# EAGLE design SolarPowerBoard (EAGLE 9.2.2)
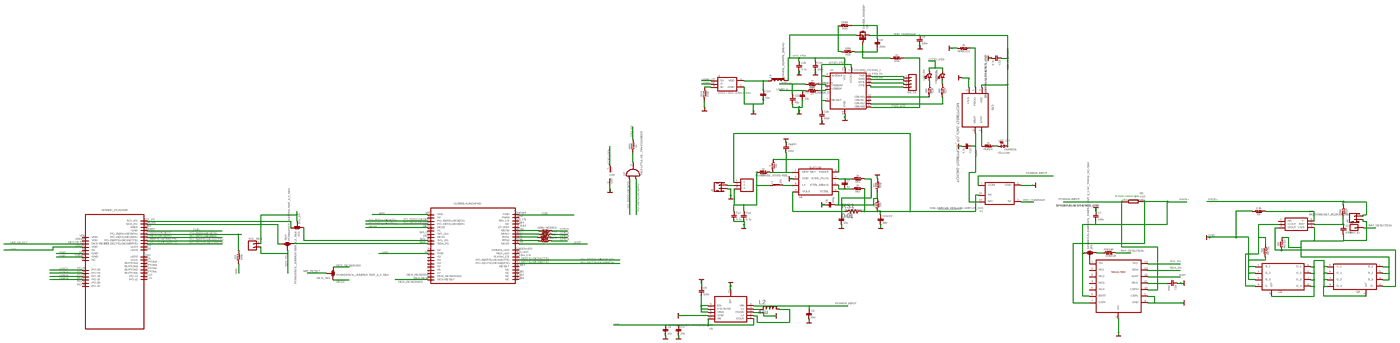
[diagram p0: schematic, sheet 1, overview]
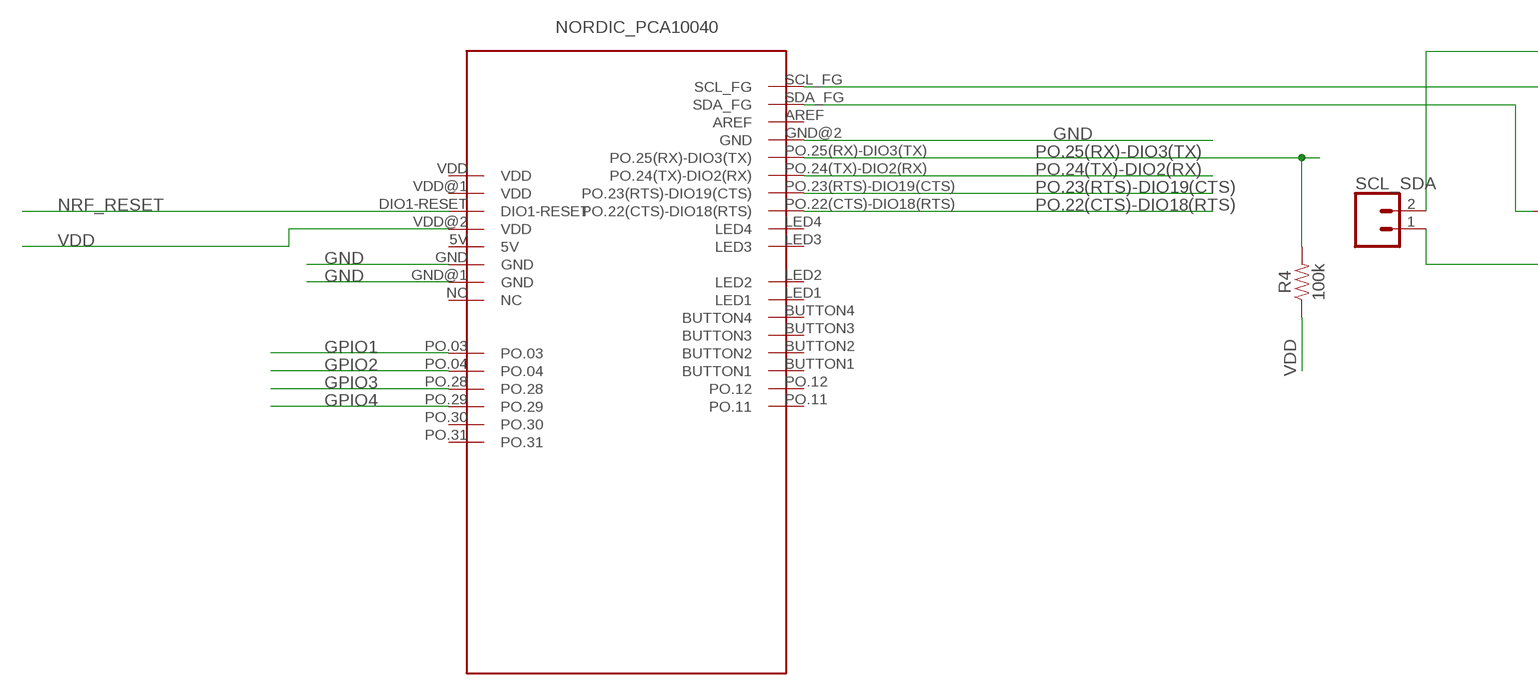
[diagram p1: schematic, sheet 1, part 1 of 4]
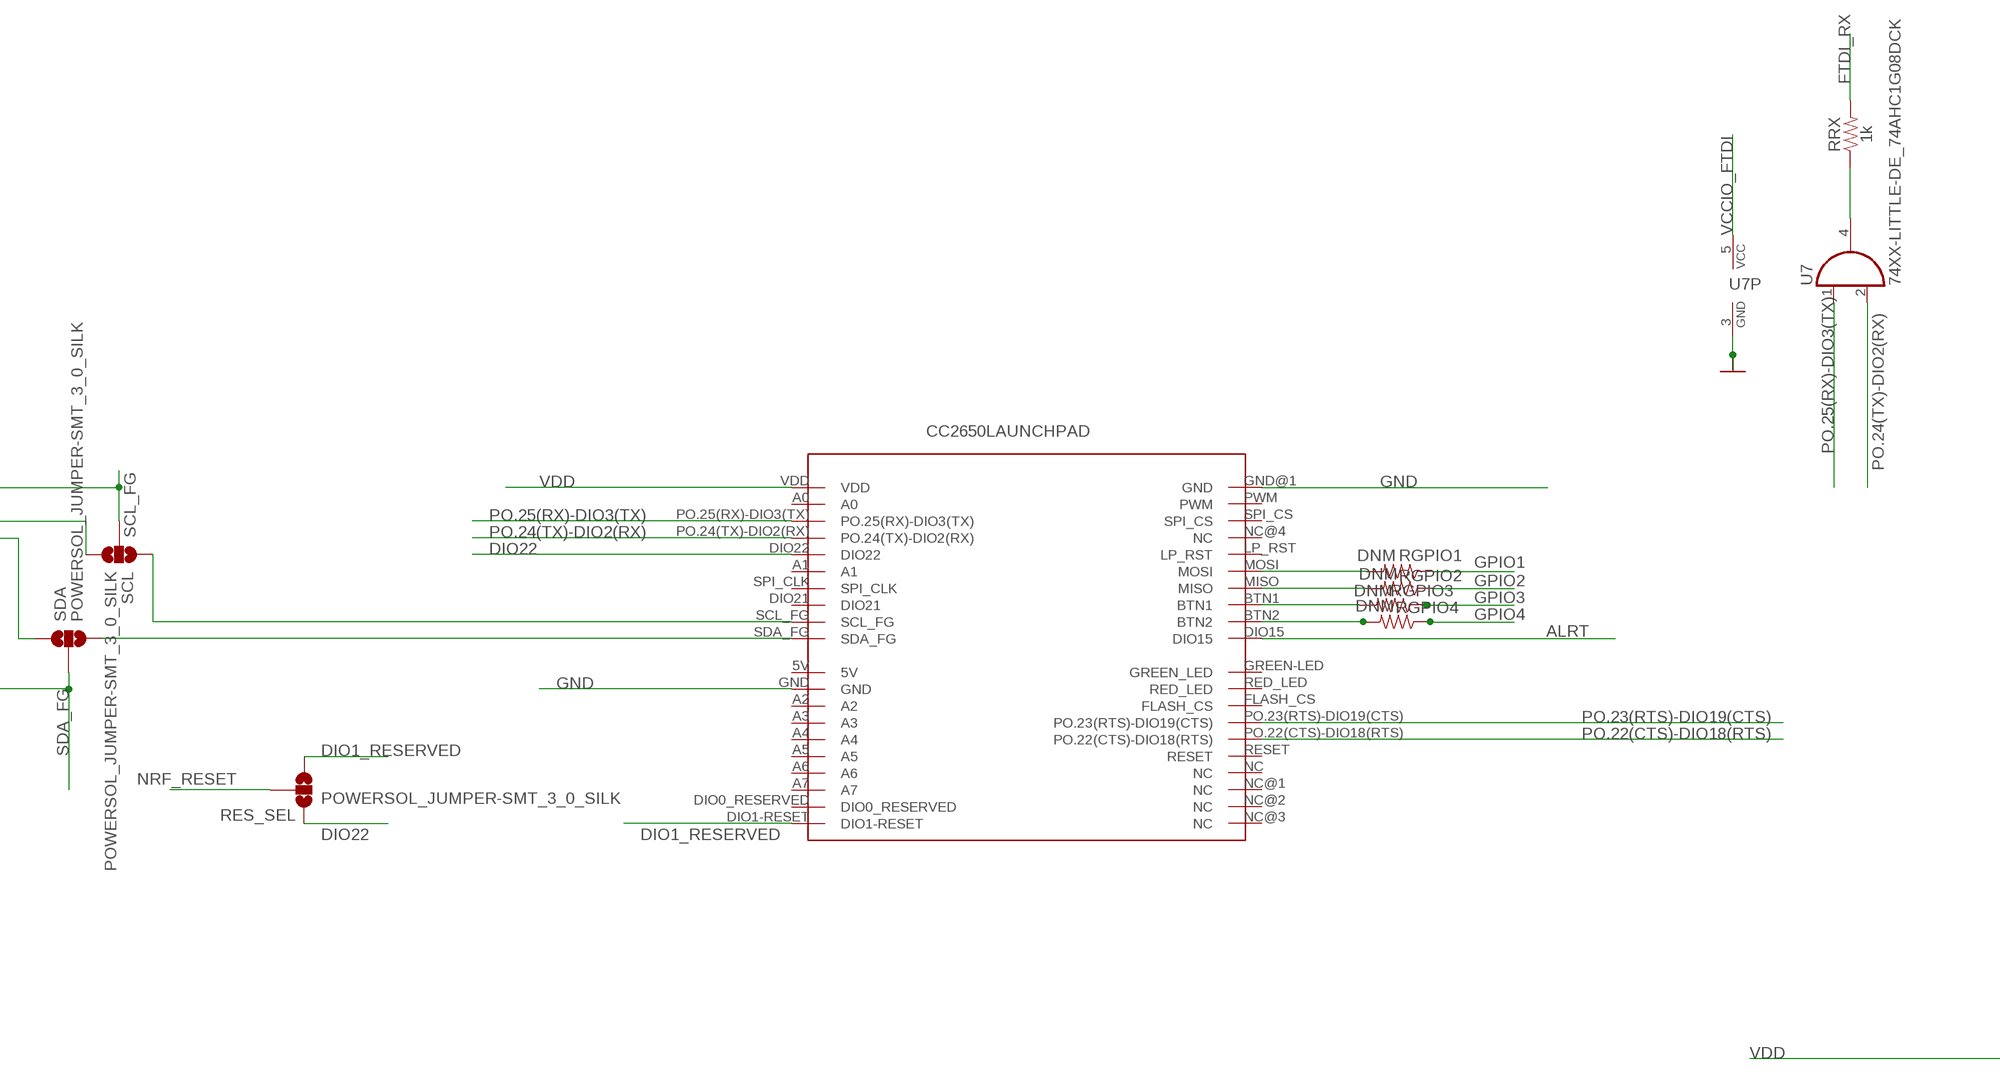
[diagram p2: schematic, sheet 1, part 2 of 4]
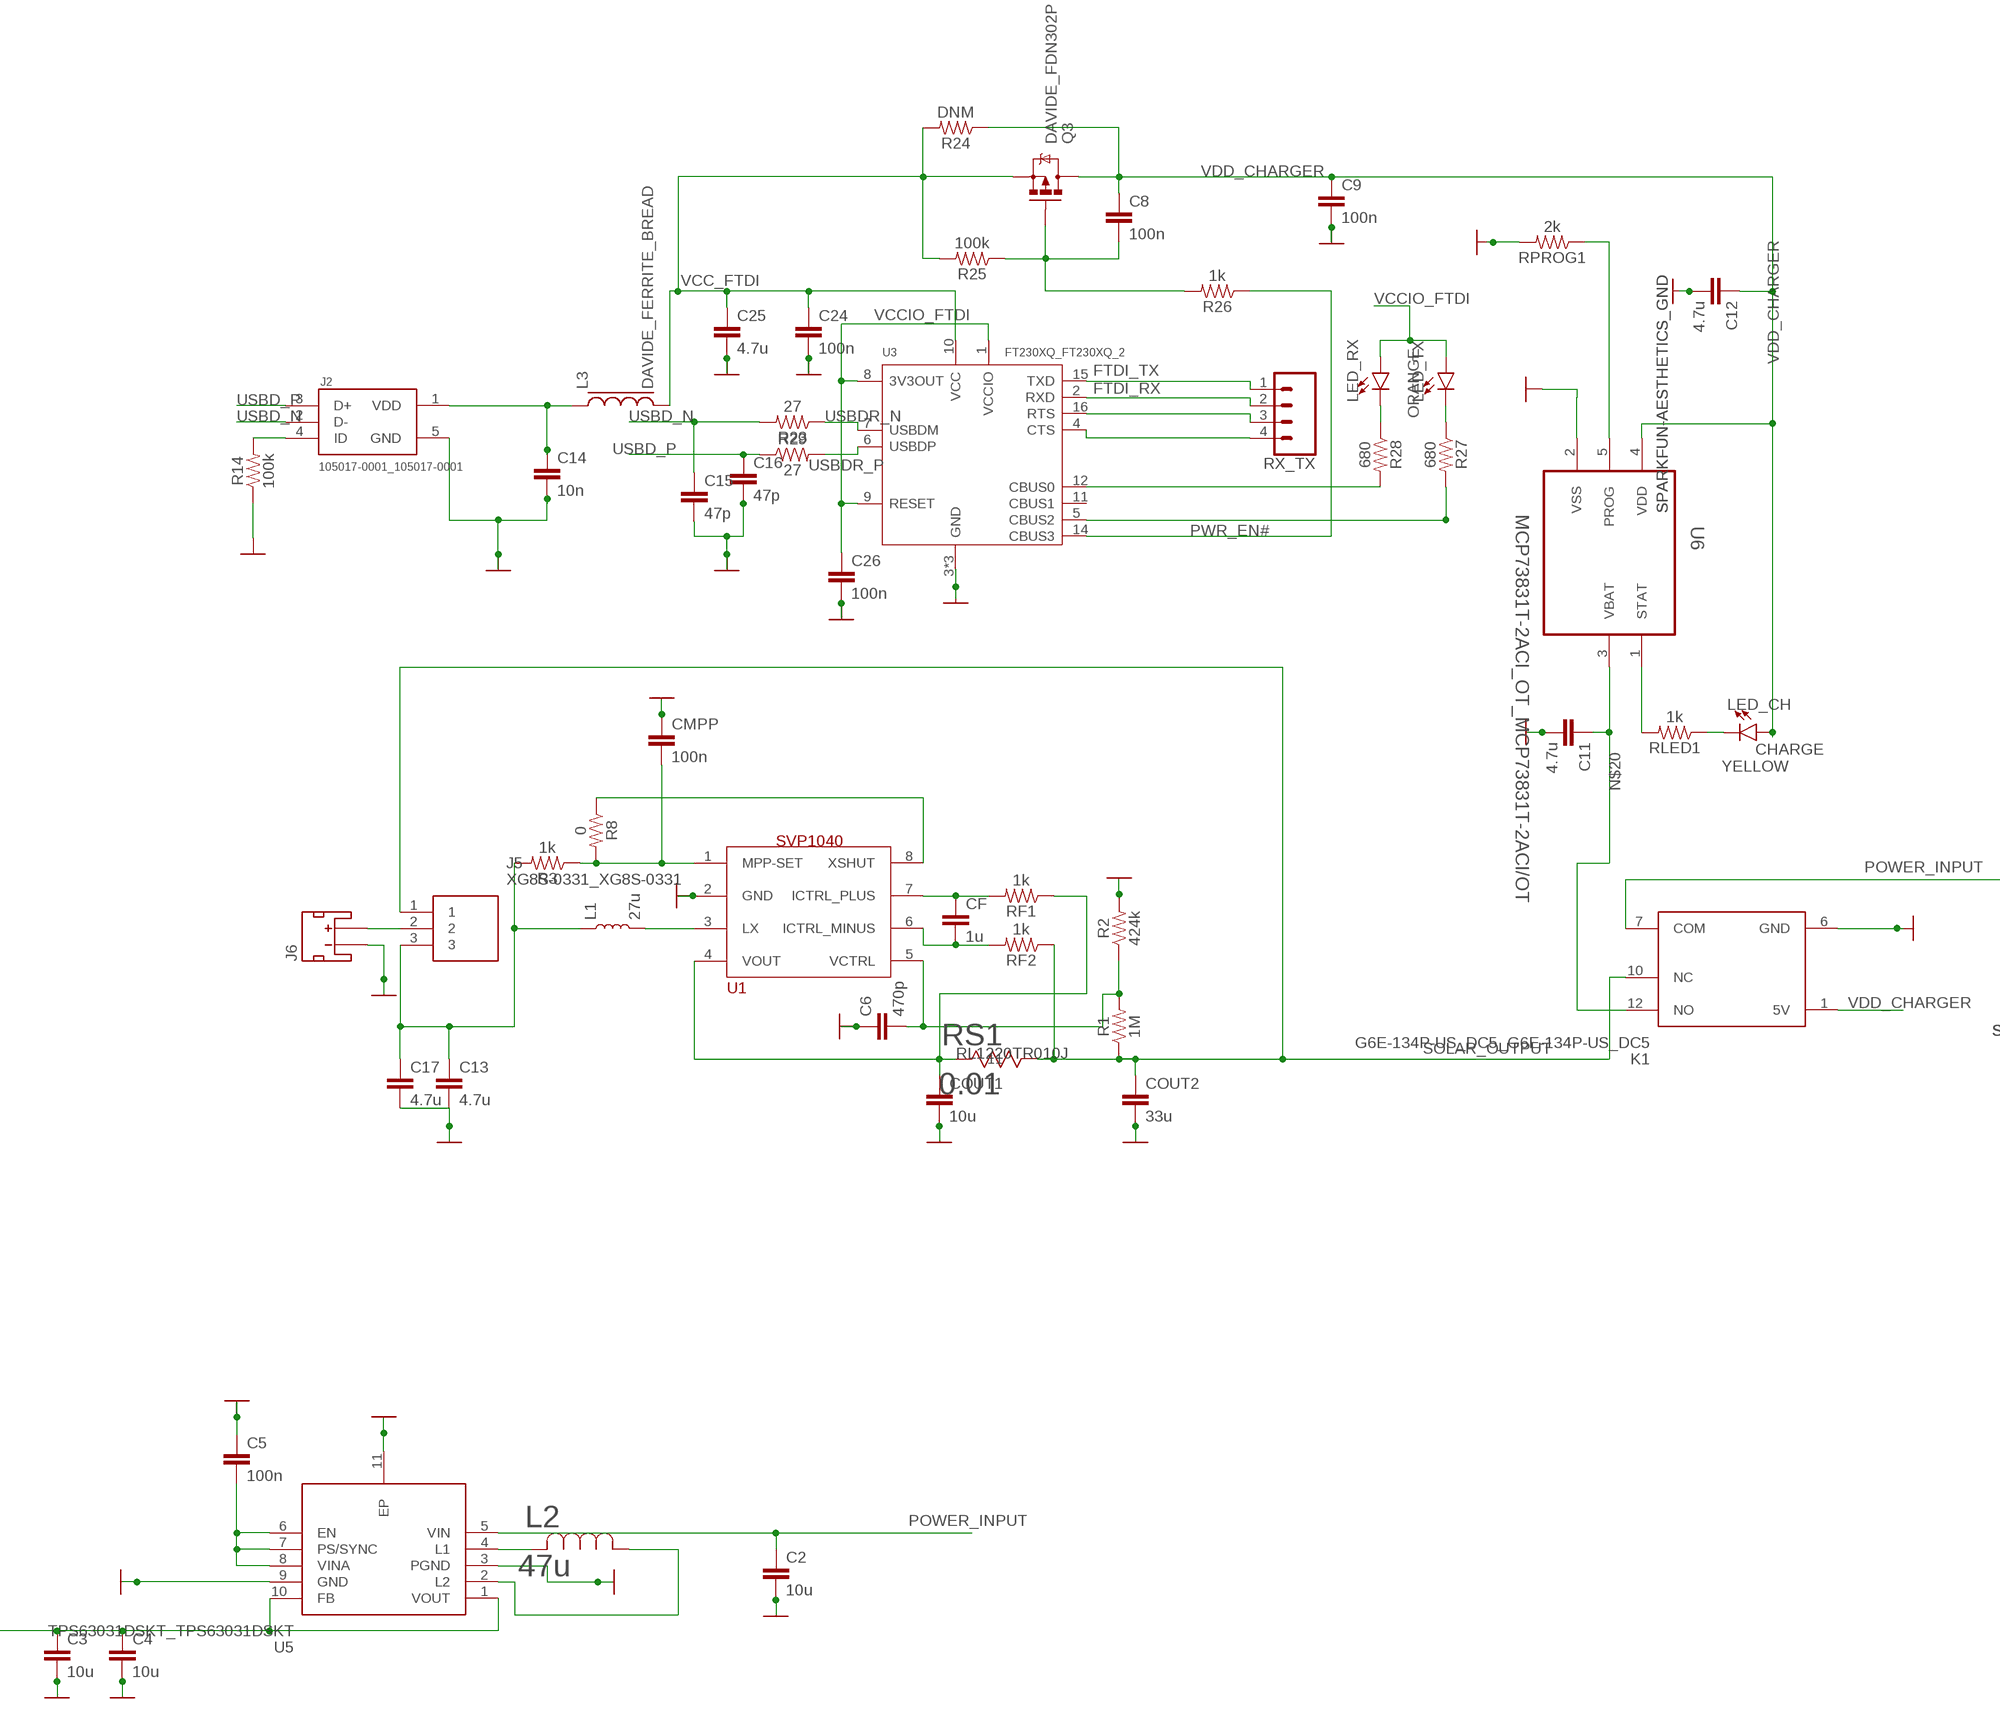
[diagram p3: schematic, sheet 1, part 3 of 4]
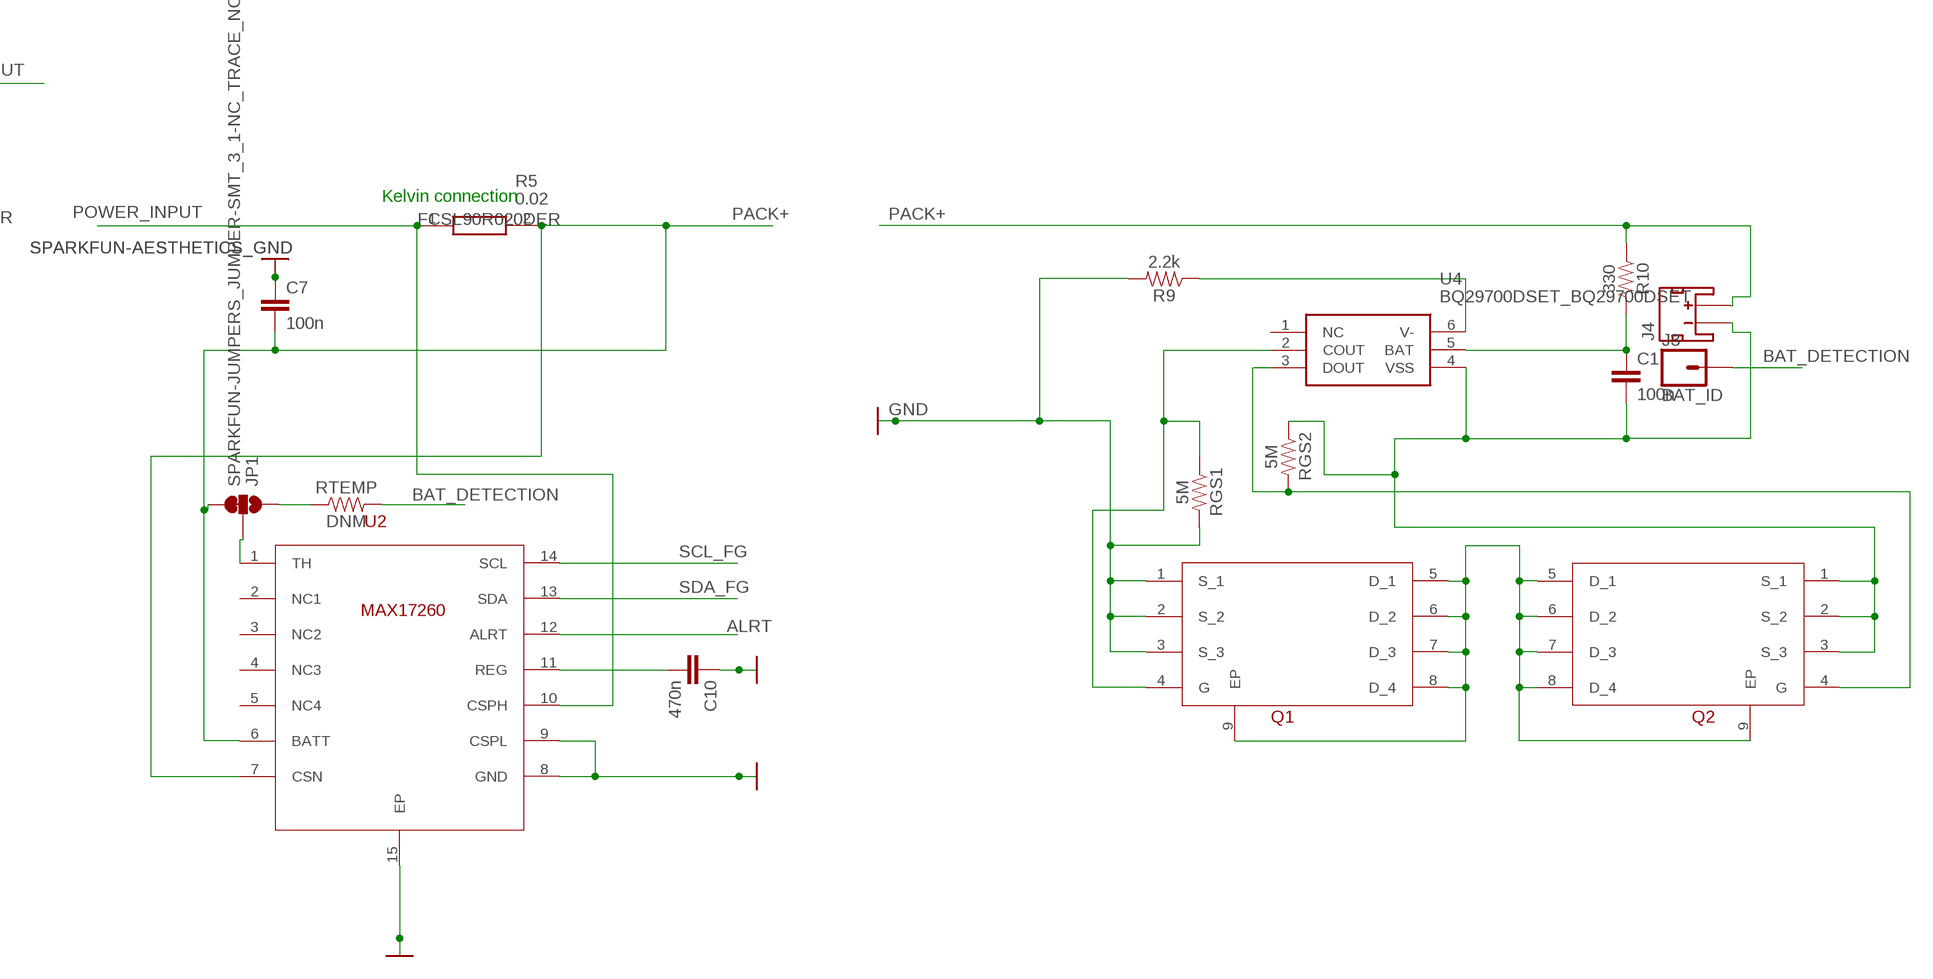
[diagram p4: schematic, sheet 1, part 4 of 4]

## Parts
B1  POWERSOL_CC2650LAUNCHPAD  [POWERSOL_SEPS_RB]
B2  POWERSOL_PCA10040NORDIC  [POWERSOL_SEPS_BB]
C1  100n  SPARKFUN-CAPACITORS_10UF-0805-10V-10%  [SPARKFUN-CAPACITORS_0805]
C2  10u  SPARKFUN-CAPACITORS_10UF-0805-10V-10%  [SPARKFUN-CAPACITORS_0805]
C3  10u  SPARKFUN-CAPACITORS_10UF-0805-10V-10%  [SPARKFUN-CAPACITORS_0805]
C4  10u  SPARKFUN-CAPACITORS_10UF-0805-10V-10%  [SPARKFUN-CAPACITORS_0805]
C5  100n  SPARKFUN-CAPACITORS_10UF-0805-10V-10%  [SPARKFUN-CAPACITORS_0805]
C6  470p  SPARKFUN-CAPACITORS_10UF-0805-10V-10%  [SPARKFUN-CAPACITORS_0805]
C7  100n  SPARKFUN-CAPACITORS_10UF-0805-10V-10%  [SPARKFUN-CAPACITORS_0805]
C8  100n  SPARKFUN-CAPACITORS_10UF-0805-10V-10%  [SPARKFUN-CAPACITORS_0805]
C9  100n  SPARKFUN-CAPACITORS_10UF-0805-10V-10%  [SPARKFUN-CAPACITORS_0805]
C10  470n  SPARKFUN-CAPACITORS_10UF-0805-10V-10%  [SPARKFUN-CAPACITORS_0805]
C11  4.7u  SPARKFUN-CAPACITORS_10UF-0805-10V-10%  [SPARKFUN-CAPACITORS_0805]
C12  4.7u  SPARKFUN-CAPACITORS_10UF-0805-10V-10%  [SPARKFUN-CAPACITORS_0805]
C13  4.7u  SPARKFUN-CAPACITORS_10UF-0805-10V-10%  [SPARKFUN-CAPACITORS_0805]
C14  10n  SPARKFUN-CAPACITORS_10UF-0805-10V-10%  [SPARKFUN-CAPACITORS_0805]
C15  47p  SPARKFUN-CAPACITORS_10UF-0805-10V-10%  [SPARKFUN-CAPACITORS_0805]
C16  47p  SPARKFUN-CAPACITORS_10UF-0805-10V-10%  [SPARKFUN-CAPACITORS_0805]
C17  4.7u  SPARKFUN-CAPACITORS_10UF-0805-10V-10%  [SPARKFUN-CAPACITORS_0805]
C24  100n  SPARKFUN-CAPACITORS_10UF-0805-10V-10%  [SPARKFUN-CAPACITORS_0805]
C25  4.7u  SPARKFUN-CAPACITORS_10UF-0805-10V-10%  [SPARKFUN-CAPACITORS_0805]
C26  100n  SPARKFUN-CAPACITORS_10UF-0805-10V-10%  [SPARKFUN-CAPACITORS_0805]
CF  1u  SPARKFUN-CAPACITORS_10UF-0805-10V-10%  [SPARKFUN-CAPACITORS_0805]
CMPP  100n  SPARKFUN-CAPACITORS_10UF-0805-10V-10%  [SPARKFUN-CAPACITORS_0805]
COUT1  10u  SPARKFUN-CAPACITORS_10UF-0805-10V-10%  [SPARKFUN-CAPACITORS_0805]
COUT2  33u  SPARKFUN-CAPACITORS_10UF-0805-10V-10%  [SPARKFUN-CAPACITORS_0805]
J2  105017-0001_105017-0001  [105017-0001_MOLEX_105017-0001]
J3  BAT_ID  SPARKFUN-CONNECTORS_CONN_01  [SPARKFUN-CONNECTORS_1X01]
J4  SOLARCOMPONENTS_JST_2MM_MALE  [SOLARCOMPONENTS_JST-2-SMD]
J5  XG8S-0331_XG8S-0331  [XG8S-0331_HDRV3W70P0X254_1X3_760X280X680]
J6  SOLARCOMPONENTS_JST_2MM_MALE  [SOLARCOMPONENTS_JST-2-SMD]
JP1  SPARKFUN-JUMPERS_JUMPER-SMT_3_1-NC_TRACE_NO-SILK  [SPARKFUN-JUMPERS_SMT-JUMPER_3_1-NC_TRACE_NO-SILK]
K1  G6E-134P-US_DC5_G6E-134P-US_DC5  [G6E-134P-US_DC5_DIP762W60P254L1595H800Q12N]
L1  27u  INDUCTOR_TH  [AXIAL-14MM]
L2  47u  SRN3010-470M_SRN3010-470M  [SRN3010-470M_IND_BOURNS_SRN3010]
L3  DAVIDE_FERRITE_BREAD  [DAVIDE_0805:1]
LED_CH  LED0603  [LED-0603]
LED_RX  LED0603  [LED-0603]
LED_TX  LED0603  [LED-0603]
Q1  SOLARCOMPONENTS_CSD16406Q3  [SOLARCOMPONENTS_CSD16327]
Q2  SOLARCOMPONENTS_CSD16406Q3  [SOLARCOMPONENTS_CSD16327]
Q3  DAVIDE_FDN302P  [DAVIDE_SOT23-3]
R1  1M  SPARKFUN-RESISTORS_0.3OHM  [SPARKFUN-RESISTORS_0805]
R2  424k  SPARKFUN-RESISTORS_0.3OHM  [SPARKFUN-RESISTORS_0805]
R3  1k  SPARKFUN-RESISTORS_0.3OHM  [SPARKFUN-RESISTORS_0805]
R4  100k  SPARKFUN-RESISTORS_0.3OHM  [SPARKFUN-RESISTORS_0805]
R5  0.02  FCSL90R020DER  [FCSL90R020DER_FOOTPRINT]
R8  0  SPARKFUN-RESISTORS_0.3OHM  [SPARKFUN-RESISTORS_0805]
R9  2.2k  SPARKFUN-RESISTORS_0.3OHM  [SPARKFUN-RESISTORS_0805]
R10  330  SPARKFUN-RESISTORS_0.3OHM  [SPARKFUN-RESISTORS_0805]
R14  100k  SPARKFUN-RESISTORS_0.3OHM  [SPARKFUN-RESISTORS_0805]
R23  27  SPARKFUN-RESISTORS_0.3OHM  [SPARKFUN-RESISTORS_0805]
R24  DNM  SPARKFUN-RESISTORS_0.3OHM  [SPARKFUN-RESISTORS_0805]
R25  100k  SPARKFUN-RESISTORS_0.3OHM  [SPARKFUN-RESISTORS_0805]
R26  1k  SPARKFUN-RESISTORS_0.3OHM  [SPARKFUN-RESISTORS_0805]
R27  680  SPARKFUN-RESISTORS_0.3OHM  [SPARKFUN-RESISTORS_0805]
R28  680  SPARKFUN-RESISTORS_0.3OHM  [SPARKFUN-RESISTORS_0805]
R29  27  SPARKFUN-RESISTORS_0.3OHM  [SPARKFUN-RESISTORS_0805]
RES_SEL  POWERSOL_JUMPER-SMT_3_0_SILK  [POWERSOL_SMT-JUMPER_3_0_NC_TRACE_SILK]
RF1  1k  SPARKFUN-RESISTORS_0.3OHM  [SPARKFUN-RESISTORS_0805]
RF2  1k  SPARKFUN-RESISTORS_0.3OHM  [SPARKFUN-RESISTORS_0805]
RGPIO1  DNM  SPARKFUN-RESISTORS_0.3OHM  [SPARKFUN-RESISTORS_0805]
RGPIO2  DNM  SPARKFUN-RESISTORS_0.3OHM  [SPARKFUN-RESISTORS_0805]
RGPIO3  DNM  SPARKFUN-RESISTORS_0.3OHM  [SPARKFUN-RESISTORS_0805]
RGPIO4  DNM  SPARKFUN-RESISTORS_0.3OHM  [SPARKFUN-RESISTORS_0805]
RGS1  5M  SPARKFUN-RESISTORS_0.3OHM  [SPARKFUN-RESISTORS_0805]
RGS2  5M  SPARKFUN-RESISTORS_0.3OHM  [SPARKFUN-RESISTORS_0805]
RLED1  1k  SPARKFUN-RESISTORS_0.3OHM  [SPARKFUN-RESISTORS_0805]
RPROG1  2k  SPARKFUN-RESISTORS_0.3OHM  [SPARKFUN-RESISTORS_0805]
RRX  1k  SPARKFUN-RESISTORS_0.3OHM  [SPARKFUN-RESISTORS_0805]
RS1  0.01  RL1220T-R010-J_RL1220T-R010-J  [RL1220T-R010-J_RES_1220]
RTEMP  DNM  SPARKFUN-RESISTORS_0.3OHM  [SPARKFUN-RESISTORS_0805]
RX_TX  SPARKFUN-CONNECTORS_CONN_04  [SPARKFUN-CONNECTORS_1X04]
SCL  POWERSOL_JUMPER-SMT_3_0_SILK  [POWERSOL_SMT-JUMPER_3_0_NC_TRACE_SILK]
SCL_SDA  SPARKFUN-CONNECTORS_CONN_02  [SPARKFUN-CONNECTORS_1X02]
SDA  POWERSOL_JUMPER-SMT_3_0_SILK  [POWERSOL_SMT-JUMPER_3_0_NC_TRACE_SILK]
U1  SOLARCOMPONENTS_SVP1040  [SOLARCOMPONENTS_TSSOP-8]
U2  SOLARCOMPONENTS_MAX17260  [SOLARCOMPONENTS_SON40P300X300X80-15N]
U3  FT230XQ_FT230XQ_2  [FT230XQ_QFN16]
U4  BQ29700DSET_BQ29700DSET  [BQ29700DSET_SON50P150X150X80-6N]
U5  TPS63031DSKT_TPS63031DSKT  [TPS63031DSKT_SON50P250X250X80-11N]
U6  MCP73831T-2ACI_OT_MCP73831T-2ACI/OT  [MCP73831T-2ACI_OT_SOT95P280X145-5N]
U7  74XX-LITTLE-DE_74AHC1G08DCK  [74XX-LITTLE-DE_SC70-5]

## Nets
ALRT: B1.DIO15 U2.12(ALRT)
BAT_DETECTION: J3.1 RTEMP.2
DIO1_RESERVED: B1.DIO1-RESET RES_SEL.3
DIO22: B1.DIO22 RES_SEL.1
DP5_UART_FTDI_RX: RRX.1 U7.4(O)
FTDI_RX: RRX.2 RX_TX.2 U3.2(RXD)
FTDI_TX: RX_TX.1 U3.15(TXD)
GND: B1.GND B1.GND@1(GND) B2.GND B2.GND@1(GND) B2.GND@2(GND) C2.2 C3.2 C4.2 C5.1 C6.1 C7.1 C9.2 C10.1 C11.2 C12.2 C13.2 C14.2 C15.2 C16.2 C17.2 C24.2 C25.2 C26.2 CMPP.1 COUT1.2 COUT2.2 J2.5(GND) J6.1(-) J6.P$1(-) K1.6(GND) Q1.1(S_1) Q1.2(S_2) Q1.3(S_3) R2.2 R9.2 R14.1 RGS1.2 RPROG1.2 U1.2(GND) U2.8(GND) U2.9(CSPL) U2.15(EP) U3.3(GND) U3.13(GND) U3.17(GND) U5.3(PGND) U5.9(GND) U5.11(EP) U6.2(VSS) U7.3(GND) ; supply symbol labelled SPARKFUN-AESTHETICS_GND
GPIO1: B2.PO.03 RGPIO1.1
GPIO2: B2.PO.04 RGPIO2.1
GPIO3: B2.PO.28 RGPIO3.1
GPIO4: B2.PO.29 RGPIO4.1
N$1: C13.1 C17.1 J5.3 L1.P$1 R3.2
N$2: RPROG1.1 U6.5(PROG)
N$3: CMPP.2 R3.1 R8.2 U1.1(MPP-SET)
N$4: R8.1 U1.8(XSHUT)
N$5: COUT1.1 RF1.1 RS1.1 U1.4(VOUT)
N$6: CF.1 RF1.2 U1.7(ICTRL_PLUS)
N$7: CF.2 RF2.2 U1.6(ICTRL_MINUS)
N$8: L2.2 U5.4(L1)
N$9: LED_CH.C RLED1.1
N$10: C6.2 R1.2 R2.1 U1.5(VCTRL)
N$11: C5.2 U5.6(EN) U5.7(PS/SYNC) U5.8(VINA)
N$12: L2.1 U5.2(L2)
N$13: RLED1.2 U6.1(STAT)
N$14: Q1.5(D_1) Q1.6(D_2) Q1.7(D_3) Q1.8(D_4) Q1.9(EP) Q2.5(D_1) Q2.6(D_2) Q2.7(D_3) Q2.8(D_4) Q2.9(EP)
N$15: Q1.4(G) RGS1.1 U4.2(COUT)
N$16: J5.2 J6.2(+) J6.P$2(+)
N$17: JP1.2 U2.1(TH)
N$18: L1.P$2 U1.3(LX)
N$19: C1.2 J4.1(-) J4.P$1(-) Q2.1(S_1) Q2.2(S_2) Q2.3(S_3) RGS2.1 U4.4(VSS)
N$20: C11.1 K1.12(NO) U6.3(VBAT)
N$21: JP1.1 RTEMP.1
N$22: Q2.4(G) RGS2.2 U4.3(DOUT)
N$24: C1.1 R10.2 U4.5(BAT)
N$25: C14.1 J2.1(VDD) L3.1
N$26: C8.2 Q3.1(G) R25.1 R26.2
N$27: J2.4(ID) R14.2
N$28: B1.MOSI RGPIO1.2
N$29: R9.1 U4.6(V-)
N$30: B1.MISO RGPIO2.2
N$31: R28.2 U3.12(CBUS0)
N$32: LED_RX.C R28.1
N$33: B1.BTN1 RGPIO3.2
N$34: RX_TX.3 U3.16(RTS)
N$35: RX_TX.4 U3.4(CTS)
N$36: B1.SDA_FG SDA.3
N$37: B1.SCL_FG SCL.1
N$38: B2.SDA_FG SDA.1
N$39: B2.SCL_FG SCL.3
N$41: B1.BTN2 RGPIO4.2
N$42: LED_TX.C R27.1
N$43: R27.2 U3.5(CBUS2)
N$45: C10.2 U2.11(REG)
NRF_RESET: B2.DIO1-RESET RES_SEL.2
PACK+: C7.2 J4.2(+) J4.P$2(+) JP1.3 R5.2 R10.1 U2.6(BATT) U2.7(CSN)
PO.22(CTS)-DIO18(RTS): B1.PO.22(CTS)-DIO18(RTS) B2.PO.22(CTS)-DIO18(RTS)
PO.23(RTS)-DIO19(CTS): B1.PO.23(RTS)-DIO19(CTS) B2.PO.23(RTS)-DIO19(CTS)
PO.24(TX)-DIO2(RX): B1.PO.24(TX)-DIO2(RX) B2.PO.24(TX)-DIO2(RX) U7.2(I1)
PO.25(RX)-DIO3(TX): B1.PO.25(RX)-DIO3(TX) B2.PO.25(RX)-DIO3(TX) R4.2 U7.1(I0)
POWER_INPUT: C2.1 K1.7(COM) R5.1 U2.10(CSPH) U5.5(VIN)
PWR_EN#: R26.1 U3.14(CBUS3)
SCL_FG: SCL.2 SCL_SDA.2 U2.14(SCL)
SDA_FG: SCL_SDA.1 SDA.2 U2.13(SDA)
SOLAR_OUTPUT: COUT2.1 J5.1 K1.10(NC) R1.1 RF2.1 RS1.2
USBD_N: C15.1 J2.2(D-) R23.2
USBD_P: C16.1 J2.3(D+) R29.1
USBDR_N: R23.1 U3.7(USBDM)
USBDR_P: R29.2 U3.6(USBDP)
VCC_FTDI: C24.1 C25.1 L3.2 Q3.2(S) R24.2 R25.2 U3.10(VCC)
VCCIO_FTDI: C26.1 LED_RX.A LED_TX.A U3.1(VCCIO) U3.8(3V3OUT) U3.9(RESET) U7.5(VCC)
VDD: B1.VDD B2.VDD@2(VDD) C3.1 C4.1 R4.1 U5.1(VOUT) U5.10(FB)
VDD_CHARGER: C8.1 C9.1 C12.1 K1.1(5V) LED_CH.A Q3.3(D) R24.1 U6.4(VDD)
Unconnected: B1.5V B1.A0 B1.A1 B1.A2 B1.A3 B1.A4 B1.A5 B1.A6 B1.A7 B1.DIO0_RESERVED B1.DIO21 B1.FLASH_CS B1.GREEN-LED(GREEN_LED) B1.LP_RST B1.NC B1.NC@1(NC) B1.NC@2(NC) B1.NC@3(NC) B1.NC@4(NC) B1.PWM B1.RED_LED B1.RESET B1.SPI_CLK B1.SPI_CS B2.5V B2.AREF B2.BUTTON1 B2.BUTTON2 B2.BUTTON3 B2.BUTTON4 B2.LED1 B2.LED2 B2.LED3 B2.LED4 B2.NC B2.PO.11 B2.PO.12 B2.PO.30 B2.PO.31 B2.VDD B2.VDD@1(VDD) J4.NC1(PAD1) J4.NC2(PAD2) J6.NC1(PAD1) J6.NC2(PAD2) U2.2(NC1) U2.3(NC2) U2.4(NC3) U2.5(NC4) U3.11(CBUS1) U4.1(NC)

## Notes on the sheet
- Kelvin connection

## Library data of the parts
B1 = SolarPowerBoard:POWERSOL_CC2650LAUNCHPAD: CC2650 LaunchPad; MPN: LAUNCHXL-CC2650; OC_NEWARK: 82Y0957
B2 = SolarPowerBoard:POWERSOL_PCA10040NORDIC: Blue Board; OC_NEWARK: unknown
C1-C17 C24-C26 CF CMPP COUT1 COUT2 = SolarPowerBoard:SPARKFUN-CAPACITORS_10UF: 10.0µF ceramic capacitors A capacitor is a passive two-terminal electrical component used to store electrical energy temporarily in an electric field.; MF: AVX CORPORATION; MPN: TPSP106M010R2000; OC_NEWARK: 22K2788; PROD_ID: CAP-11330
J2 = SolarPowerBoard:105017-0001_105017-0001; AVAILABILITY: Good; DESCRIPTION: Conn USB Type B M 5 POS 0.65mm Solder RA Thru-Hole 5 Terminal 1 Port Embossed T/R; MP: 105017-0001; MPN: 105017-0001; OC_NEWARK: 28X2628; PACKAGE: None; PRICE: 0.49 USD
J3 = SolarPowerBoard:SPARKFUN-CONNECTORS_CONN_01: Single connection point. Often used as Generic Header-pin footprint for 0.1 inch spaced/style header connections On any of the 0.1 inch spaced packages, you can populate with these: Break Away Headers - Straight <https://www.sparkfun.com/products/116> (PRT-00116) Break Away Male Headers - Right Angle <https://www.sparkfun.com/products/553> (PRT-00553) Female Headers <https://www.sparkfun.com/products/115> (PRT-00115) Break Away Headers - Machine Pin <https://www.sparkfun.com/products/117> (PRT-00117) Break Away Female Headers - Swiss Machine Pin <https://www.sparkfun.com/products/743> (PRT-00743) This device is also useful as a general connection point to wire up your design to another part of your project. Our various solder wires solder well into these plated through hole pads. Hook-Up Wire - Assortment (Stranded, 22 AWG) <https://www.sparkfun.com/products/11375> (PRT-11375) Hook-Up Wire - Assortment (Solid Core, 22 AWG) <https://www.sparkfun.com/products/11367> (PRT-11367) View the entire wire category on our website here <https://www.sparkfun.com/categories/141> Special notes: SMTSO-256-ET is a "flush mount" nut for a 4-40 screw. We mostly use this on specialty testbeds; it is a nice way to connect hardware to your PCB at an adjustable hieght. Also note, the SNAP packages are for using a snappable style connector. We sell a baggie of snaps and they are also used on two LilyPad designs: Snap Assortment - 30 pack (male and female) <https://www.sparkfun.com/products/11347> (DEV-11347) LilyPad Arduino SimpleSnap <https://www.sparkfun.com/products/10941> (DEV-10941) LilyPad SimpleSnap Protoboard <https://www.sparkfun.com/products/10940> (DEV-10940)
J4 J6 = SolarPowerBoard:SOLARCOMPONENTS_JST_2MM_MALE: JST 2MM MALE RA CONNECTOR Two pin, compact surface mount connector. Commonly used as a battery input connection point. We really like the solid locking feeling and high current rating on these small connectors. We use these all the time as battery connectors. Mates to single-cell LiPo batteries. Here is the connector we sell at SparkFun: JST Right Angle Connector - White <https://www.sparkfun.com/products/8612> (PRT-08612) Datasheet <http://www.sparkfun.com/datasheets/Prototyping/Connectors/JST-Horizontal.pdf> It was used on these SparkFun products: SparkFun MOSFET Power Controller <https://www.sparkfun.com/products/11214> (PRT-11214) SparkFun Battery Babysitter - LiPo Battery Manager <https://www.sparkfun.com/products/13777> (PRT-13777) And many, many others that required a lipo battery connection.; PROD_ID: CONN-11443; SF_ID: PRT-08612
J5 = SolarPowerBoard:XG8S-0331_XG8S-0331: Headers & Wire Housings Header Plug Au Plate Single Row 3 Pin Source: Datasheet <https://www.arrow.com/en/products/xg8s-0331/omron>; ARROW_PART_NUMBER: XG8S-0331; DESCRIPTION: Headers & Wire Housings Header Plug Au Plate Single Row 3 Pin; HEIGHT: 6.8mm; MANUFACTURER_NAME: Omron Electronics; MANUFACTURER_PART_NUMBER: XG8S-0331
JP1 = SolarPowerBoard:SPARKFUN-JUMPERS_JUMPER-SMT_3_1-NC_TRACE: Normally closed trace jumper (1 of 2 connections) This jumper has a trace between two pads so it's normally closed (NC). The other connection is normally open (NO). Use a razor knife to open the connection. For best results follow the IPC guidelines for cutting traces: Cutout at least 0.063 mm (0.005 in). Remove all loose material to clean up the cut area. Seal the cut with an approved epoxy. Reapply solder to reclose the connection, or to close the NO connection.; OC_NEWARK: unknown
K1 = SolarPowerBoard:G6E-134P-US_DC5_G6E-134P-US_DC5: Low Signal Relays - PCB Relay Source: Datasheet <https://componentsearchengine.com/Datasheets/1/G6E-134P-US DC5.pdf>; ARROW_PART_NUMBER: G6E-134P-US DC5; DESCRIPTION: Low Signal Relays - PCB Relay; HEIGHT: 8mm; MANUFACTURER_NAME: Omron Electronics; MANUFACTURER_PART_NUMBER: G6E-134P-US DC5
L1 = SolarPowerBoard:INDUCTOR_TH; MPN: B82144F2273K000
L2 = SolarPowerBoard:SRN3010-470M_SRN3010-470M; MANUFACTURER_PART_NUMBER: SRN3010470M; MPN: SRN3010-470M; OC_NEWARK: 54W0048; VENDOR: Bourns Electronics
L3 = SolarPowerBoard:DAVIDE_FERRITE_BREAD; MPN: MI0805K601R-10; OC_NEWARK: unknown
LED_CH = SolarPowerBoard:LED: LED (Generic) Standard schematic elements and footprints for 5mm, 3mm, 1206, and 0603 sized LEDs. Generic LEDs with no color specified.; COLOR: YELLOW; FUNCTION: CHARGE
LED_RX = SolarPowerBoard:LED: LED (Generic) Standard schematic elements and footprints for 5mm, 3mm, 1206, and 0603 sized LEDs. Generic LEDs with no color specified.; COLOR: ORANGE; FUNCTION: RX
LED_TX = SolarPowerBoard:LED: LED (Generic) Standard schematic elements and footprints for 5mm, 3mm, 1206, and 0603 sized LEDs. Generic LEDs with no color specified.; COLOR: YELLOW; FUNCTION: TX
Q1 Q2 = SolarPowerBoard:SOLARCOMPONENTS_CSD16406Q3; MPN: CSD16406Q3; OC_NEWARK: 06R3511
Q3 = SolarPowerBoard:DAVIDE_FDN302P; OC_NEWARK: unknown
R1-R4 R8-R10 R14 R23-R29 RF1 RF2 RGPIO1-RGPIO4 RGS1 RGS2 RLED1 RPROG1 RRX RTEMP = SolarPowerBoard:SPARKFUN-RESISTORS_0.3OHM: Generic Resistor Package; MPN: RLP73N2AR30JTD; OC_NEWARK: 43AC3996
R5 = SolarPowerBoard:FCSL90R020DER: Susumu Co KRL Series Metal Foil Surface Mount Fixed Resistor 2012 Case 20m 1% 1W 50ppm/C Source: Datasheet <https://www.susumu.co.jp/common/pdf/n_catalog_partition19_en.pdf>; MANUFACTURER_CODE: FCSL90R020DER
RES_SEL SCL SDA = SolarPowerBoard:POWERSOL_JUMPER-SMT_3_0_SILK; OC_NEWARK: unknown
RS1 = SolarPowerBoard:RL1220T-R010-J_RL1220T-R010-J; MANUFACTURER_PART_NUMBER: RL1220TR010J; VENDOR: Susumu
RX_TX = SolarPowerBoard:SPARKFUN-CONNECTORS_CONN_04: Multi connection point. Often used as Generic Header-pin footprint for 0.1 inch spaced/style header connections On any of the 0.1 inch spaced packages, you can populate with these: Break Away Headers - Straight <https://www.sparkfun.com/products/116> (PRT-00116) Break Away Male Headers - Right Angle <https://www.sparkfun.com/products/553> (PRT-00553) Female Headers <https://www.sparkfun.com/products/115> (PRT-00115) Break Away Headers - Machine Pin <https://www.sparkfun.com/products/117> (PRT-00117) Break Away Female Headers - Swiss Machine Pin <https://www.sparkfun.com/products/743> (PRT-00743) For SCREWTERMINALS and SPRING TERMINALS visit here: Screw Terimnals on SparkFun.com <https://www.sparkfun.com/search/results?term=Screw+Terminals> (5mm/3.5mm/2.54mm spacing) This device is also useful as a general connection point to wire up your design to another part of your project. Our various solder wires solder well into these plated through hole pads. Hook-Up Wire - Assortment (Stranded, 22 AWG) <https://www.sparkfun.com/products/11375> (PRT-11375) Hook-Up Wire - Assortment (Solid Core, 22 AWG) <https://www.sparkfun.com/products/11367> (PRT-11367) View the entire wire category on our website here <https://www.sparkfun.com/categories/141> Special notes: Molex polarized connector foot print use with SKU : PRT-08231 with associated crimp pins and housings. 1MM SMD Version SKU: PRT-10208; OC_NEWARK: unknown; PROD_ID: CONN-09696
SCL_SDA = SolarPowerBoard:SPARKFUN-CONNECTORS_CONN_02: Multi connection point. Often used as Generic Header-pin footprint for 0.1 inch spaced/style header connections On any of the 0.1 inch spaced packages, you can populate with these: Break Away Headers - Straight <https://www.sparkfun.com/products/116> (PRT-00116) Break Away Male Headers - Right Angle <https://www.sparkfun.com/products/553> (PRT-00553) Female Headers <https://www.sparkfun.com/products/115> (PRT-00115) Break Away Headers - Machine Pin <https://www.sparkfun.com/products/117> (PRT-00117) Break Away Female Headers - Swiss Machine Pin <https://www.sparkfun.com/products/743> (PRT-00743) For SCREWTERMINALS and SPRING TERMINALS visit here: Screw Terimnals on SparkFun.com <https://www.sparkfun.com/search/results?term=Screw+Terminals> (5mm/3.5mm/2.54mm spacing) This device is also useful as a general connection point to wire up your design to another part of your project. Our various solder wires solder well into these plated through hole pads. Hook-Up Wire - Assortment (Stranded, 22 AWG) <https://www.sparkfun.com/products/11375> (PRT-11375) Hook-Up Wire - Assortment (Solid Core, 22 AWG) <https://www.sparkfun.com/products/11367> (PRT-11367) View the entire wire category on our website here <https://www.sparkfun.com/categories/141> Special notes: Molex polarized connector foot print use with: PRT-08233 with associated crimp pins and housings. 2.54_SCREWTERM for use with PRT-10571. 3.5mm Screw Terminal footprints for PRT-08084 5mm Screw Terminal footprints for use with PRT-08432; OC_NEWARK: unknown
U1 = SolarPowerBoard:SOLARCOMPONENTS_SVP1040; OC_NEWARK: unknown
U2 = SolarPowerBoard:SOLARCOMPONENTS_MAX17260; MPN: MAX17260SEWL+; OC_NEWARK: 62AC7157
U3 = SolarPowerBoard:FT230XQ_FT230XQ_2; MPN: FT230XQ-R; OC_NEWARK: 83T7086
U4 = SolarPowerBoard:BQ29700DSET_BQ29700DSET: Texas Instruments BQ29700DSET, Battery Charger Lithium-Ion, Lithium-Polymer, 6-Pin WSON Source: Datasheet <http://www.ti.com/lit/ds/symlink/bq2970.pdf>; ARROW_PART_NUMBER: BQ29700DSET; ARROW_PRICE-STOCK: https://www.arrow.com/en/products/bq29700dset/texas-instruments; DESCRIPTION: Texas Instruments BQ29700DSET, Battery Charger Lithium-Ion, Lithium-Polymer, 6-Pin WSON; HEIGHT: 0.8mm; MANUFACTURER_NAME: Texas Instruments; MANUFACTURER_PART_NUMBER: BQ29700DSET; MPN: BQ29700DSET; OC_NEWARK: 78X4150; RS_PART_NUMBER: 1456841; RS_PRICE-STOCK: http://uk.rs-online.com/web/p/products/1456841
U5 = SolarPowerBoard:TPS63031DSKT_TPS63031DSKT: High Efficient Single Inductor Buck-Boost Converter with 1-A Switches Source: Datasheet <http://www.ti.com/lit/gpn/tps63031>; ARROW_PART_NUMBER: TPS63031DSKT; ARROW_PRICE-STOCK: https://www.arrow.com/en/products/tps63031dskt/texas-instruments; DESCRIPTION: High Efficient Single Inductor Buck-Boost Converter with 1-A Switches; HEIGHT: 0.8mm; MANUFACTURER_NAME: Texas Instruments; MANUFACTURER_PART_NUMBER: TPS63031DSKT; MPN: TPS63031DSKT; OC_NEWARK: 25P9270; RS_PART_NUMBER: 6989091P; RS_PRICE-STOCK: http://uk.rs-online.com/web/p/products/6989091P
U6 = SolarPowerBoard:MCP73831T-2ACI_OT_MCP73831T-2ACI/OT: Charge Management Controller; AVAILABILITY: Good; DESCRIPTION: MCP73831 Series Single-Cell Li-Ion/Li-Polymer Battery Charge Controller SOT-23-5; MF: Microchip; MP: MCP73831T-2ACI/OT; PACKAGE: SOT-23 Microchip; PRICE: 0.51 USD
U7 = SolarPowerBoard:74XX-LITTLE-DE_74*1G08: 2-input AND gate; MF: TEXAS INSTRUMENTS; MPN: SN74AHC1G08DCKR; OC_NEWARK: 19C1781

## Board
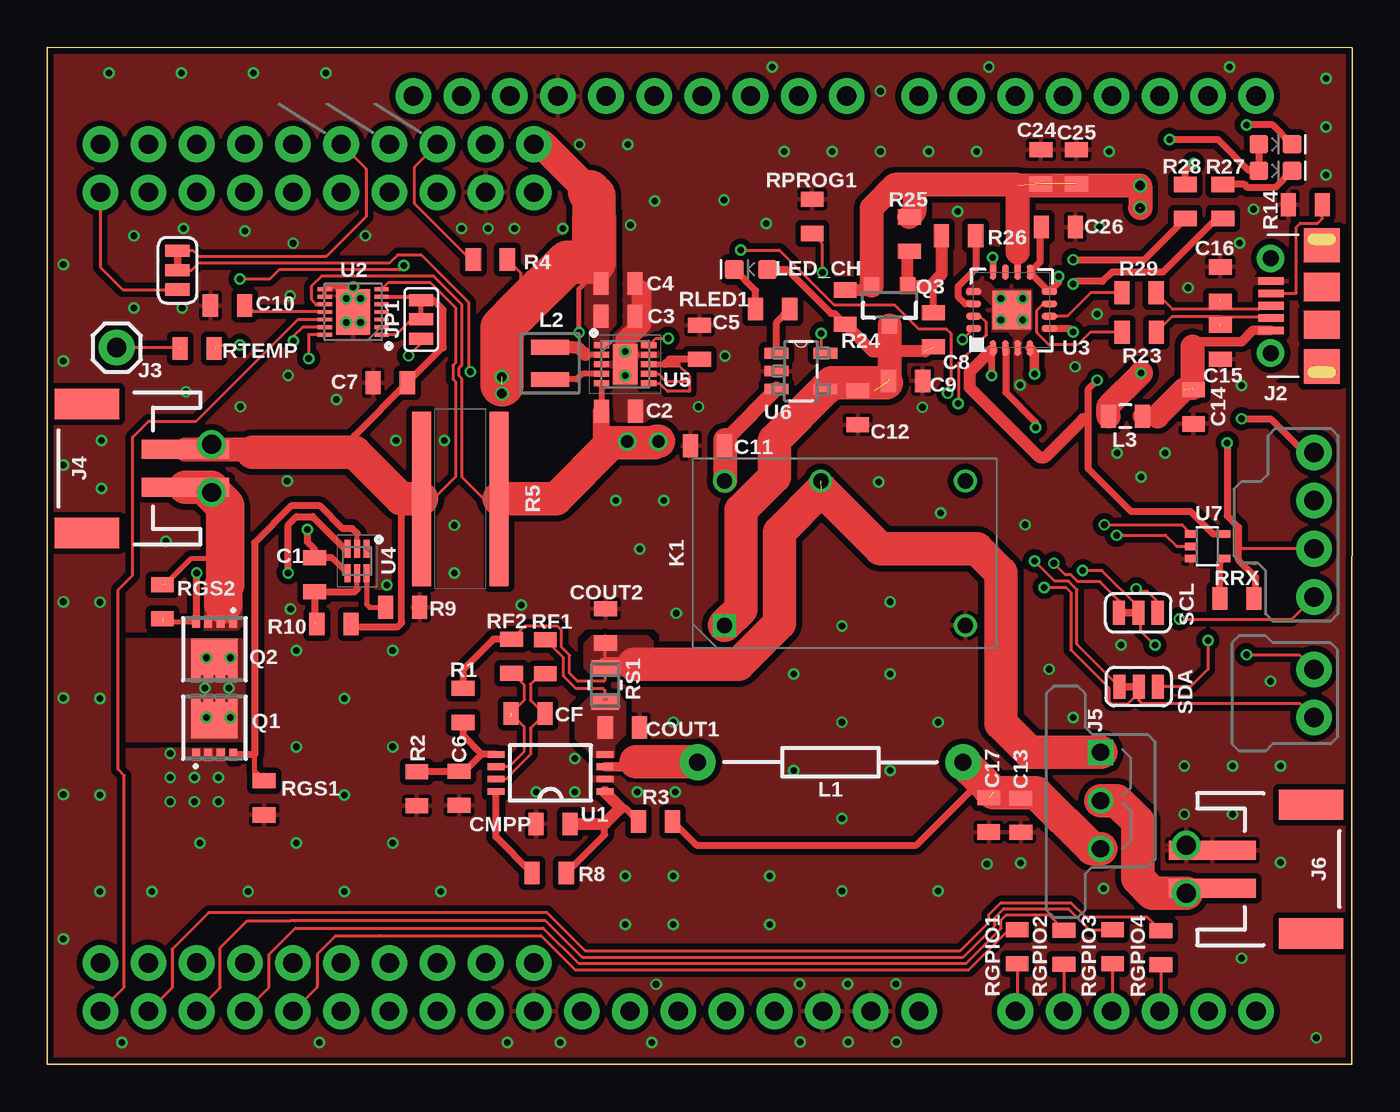
[diagram p5: board, top side]
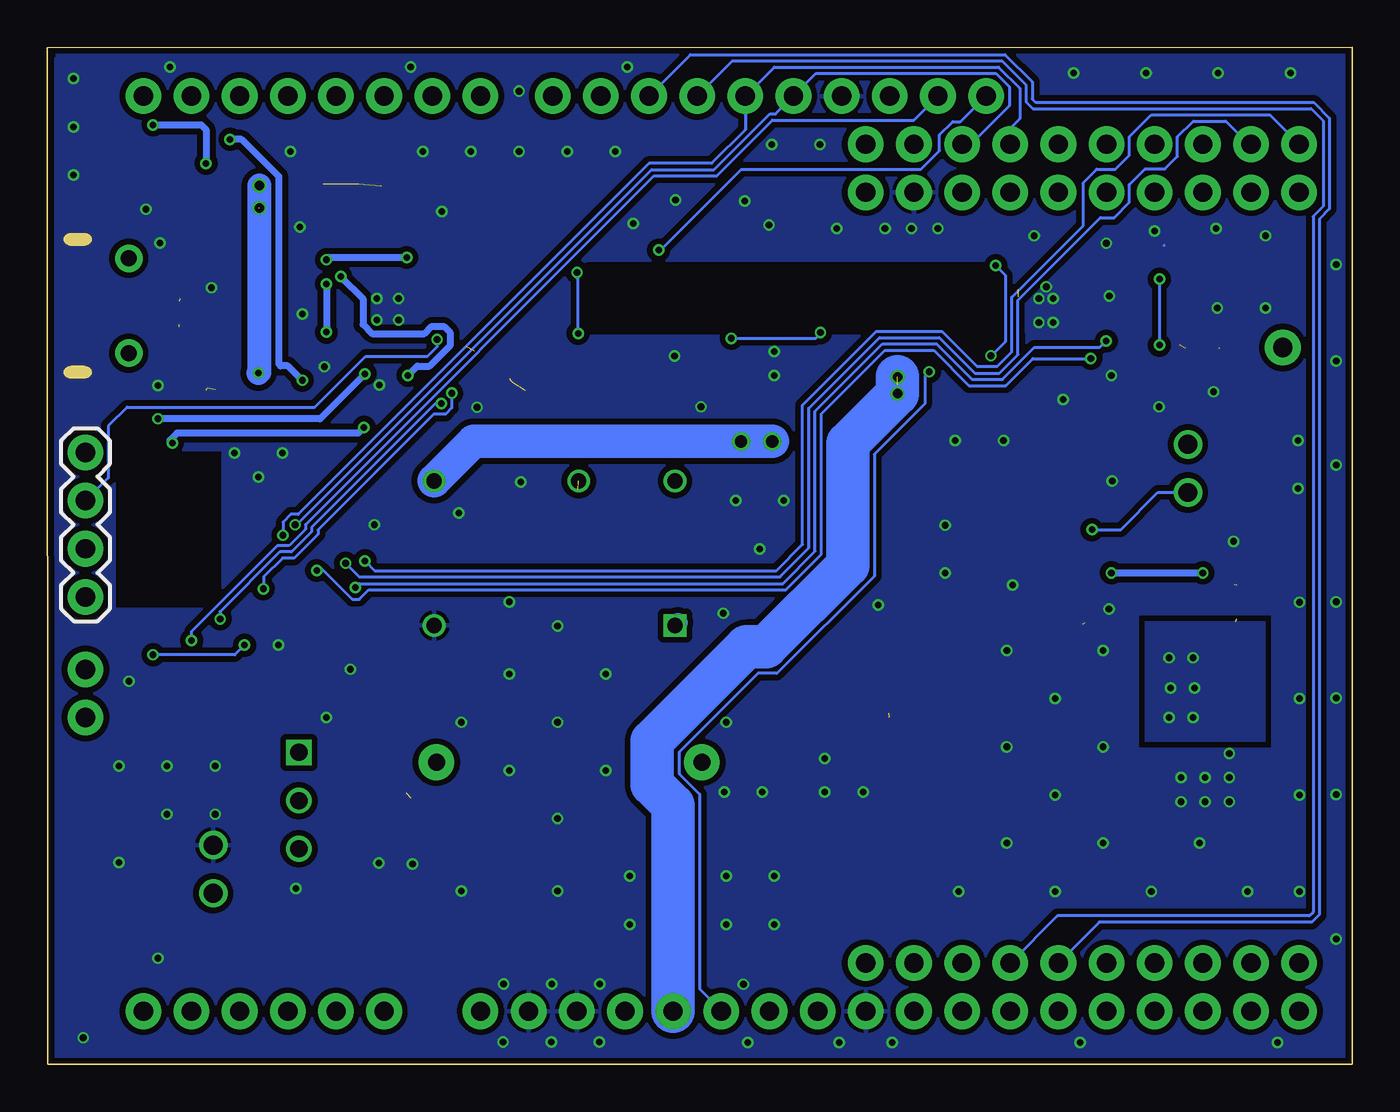
[diagram p6: board, bottom side, seen from below]

Size 68.82 x 53.62 mm. Coordinates in mm from the lower left corner, seen from the top.
Outline: 0,0 0,53.62 68.82,53.6 68.79,0 0,0
Copper layers (1*16): Top 0.035mm / dielectric 1.55mm / Bottom 0.035mm
Design rules "eC_2Layer_PClass6_BaseCopperO35": minimum track width 0.15mm, minimum drill 0.35mm, track to track 0.175mm, track to pad 0.175mm, pad to pad 0.175mm, via to via 0.175mm, smd to smd 0mil, copper to edge 0.25mm, drill to drill 0.35mm, minimum pad ring 0.175mm, minimum via ring 0.125mm, stop-mask expansion 0mil, vias tented up to drill 0.45mm, thermal gap 0.2mm
bKeepout: area 19.1,38.5 to 40.5,42.3; area 59.7,24.1 to 65.2,32.3; area 19.1,38.5 to 40.5,42.3

### Footprints (pad centres in the part's own frame; a part is rotated, then mirrored left to right if it is on the bottom)
POWERSOL_SEPS_RB = drill 1.016 pad 1.88: 5V 0,2.54; A0 2.54,0; A1 12.7,0; A2 5.08,2.54; A3 7.62,2.54; A4 10.16,2.54; A5 12.7,2.54; A6 15.24,2.54; A7 17.78,2.54; BTN1 17.78,45.72; BTN2 20.32,45.72; DIO0_RESERVED 20.32,2.54; DIO1-RESET 22.86,2.54; DIO15 22.86,45.72; DIO21 17.78,0; DIO22 10.16,0; FLASH_CS 5.08,43.18; GND 2.54,2.54; GND@1 0,45.72; GREEN-LED 0,43.18; LP_RST 10.16,45.72; MISO 15.24,45.72; MOSI 12.7,45.72; NC 15.24,43.18; NC@1 17.78,43.18; NC@2 20.32,43.18; NC@3 22.86,43.18; NC@4 7.62,45.72; PO.22(CTS)-DIO18(RTS) 10.16,43.18; PO.23(RTS)-DIO19(CTS) 7.62,43.18; PO.24(TX)-DIO2(RX) 7.62,0; PO.25(RX)-DIO3(TX) 5.08,0; PWM 2.54,45.72; RED_LED 2.54,43.18; RESET 12.7,43.18; SCL_FG 20.32,0; SDA_FG 22.86,0; SPI_CLK 15.24,0; SPI_CS 5.08,45.72; VDD 0,0
POWERSOL_SEPS_BB = drill 1.016 pad 1.88: 5V -25.4,0; AREF -39.37,48.26; BUTTON1 -5.08,48.26; BUTTON2 -7.62,48.26; BUTTON3 -10.16,48.26; BUTTON4 -12.7,48.26; DIO1-RESET -30.48,0; GND -22.86,0; GND@1 -20.32,0; GND@2 -36.83,48.26; LED1 -15.24,48.26; LED2 -17.78,48.26; LED3 -21.59,48.26; LED4 -24.13,48.26; NC -17.78,0; PO.03 -12.7,0; PO.04 -10.16,0; PO.11 0,48.26; PO.12 -2.54,48.26; PO.22(CTS)-DIO18(RTS) -26.67,48.26; PO.23(RTS)-DIO19(CTS) -29.21,48.26; PO.24(TX)-DIO2(RX) -31.75,48.26; PO.25(RX)-DIO3(TX) -34.29,48.26; PO.28 -7.62,0; PO.29 -5.08,0; PO.30 -2.54,0; PO.31 0,0; SCL_FG -44.45,48.26; SDA_FG -41.91,48.26; VDD -35.56,0; VDD@1 -33.02,0; VDD@2 -27.94,0
SPARKFUN-CAPACITORS_0805 = smd 0.8 x 1.2: 1 -0.9,0; 2 0.9,0
105017-0001_MOLEX_105017-0001 = smd 0.4 x 1.35: 1 -1.3,2.675; 2 -0.65,2.675; 3 0,2.675; 4 0.65,2.675; 5 1.3,2.675 | drill 0.85 pad 1.45: P$1 -2.5,2.7; P$2 2.5,2.7 | smd 1.5 x 1.9: P$8 -1,0; P$9 1,0 | smd 1.8 x 1.9: P$10 -3.2,0; P$11 3.2,0
SPARKFUN-CONNECTORS_1X01 = drill 1.016 pad 1.88: 1 0,0
SOLARCOMPONENTS_JST-2-SMD = smd 1 x 4.6: 1 -1,-3.7; 2 1,-3.7 | smd 1.6 x 3.4: NC1 -3.4,1.5; NC2 3.4,1.5 | drill 1: P$1 -1.27,-5.08; P$2 1.27,-5.08
XG8S-0331_HDRV3W70P0X254_1X3_760X280X680 = drill 0.9 pad 1.35 square: 1 0,0 | drill 0.9 pad 1.35: 2 2.54,0; 3 5.08,0
SPARKFUN-JUMPERS_SMT-JUMPER_3_1-NC_TRACE_NO-SILK = smd 0.635 x 1.27: 1 -1.016,0; 2 0,0; 3 1.016,0
G6E-134P-US_DC5_DIP762W60P254L1595H800Q12N = drill 0.8 pad 1.2 square: 1 -3.81,6.35 | drill 0.8 pad 1.2: 6 -3.81,-6.35; 7 3.81,-6.35; 10 3.81,1.27; 12 3.81,6.35
AXIAL-14MM = drill 0.9 pad 1.88: P$1 -7,0; P$2 7,0
SRN3010-470M_IND_BOURNS_SRN3010 = smd 0.787 x 2.007: 1 -0.851,0; 2 0.851,0
DAVIDE_0805:1 = smd 0.8 x 1.2: 1 -0.9,0; 2 0.9,0
LED-0603 = smd 1 x 1: A -0.877,0; C 0.877,0
SOLARCOMPONENTS_CSD16327 = smd 0.42 x 0.63: 1 -0.975,-1.435; 2 -0.325,-1.435; 3 0.325,-1.435; 4 0.975,-1.435 | smd 0.5 x 0.41: 5 0.975,1.545; 6 0.325,1.545; 7 -0.325,1.545; 8 -0.975,1.545 | smd 2.45 x 1.9: 9 0,0.39
DAVIDE_SOT23-3 = smd 0.8 x 0.9: 1 -0.95,-1; 2 0.95,-1; 3 0,1.1
SPARKFUN-RESISTORS_0805 = smd 0.8 x 1.2: 1 -0.9,0; 2 0.9,0
FCSL90R020DER_FOOTPRINT = smd 1 x 9.2: 1 -2.05,0; 2 2.05,0
POWERSOL_SMT-JUMPER_3_0_NC_TRACE_SILK = smd 0.635 x 1.27: 1 -1.016,0; 2 0,0; 3 1.016,0
RL1220T-R010-J_RES_1220 = smd 0.803 x 1.45: 1 -0.902,0; 2 0.902,0
SPARKFUN-CONNECTORS_1X04 = drill 1.016 pad 1.88: 1 0,0; 2 2.54,0; 3 5.08,0; 4 7.62,0
SPARKFUN-CONNECTORS_1X02 = drill 1.016 pad 1.88: 1 0,0; 2 2.54,0
SOLARCOMPONENTS_TSSOP-8 = smd 0.9 x 0.35: 1 -2.875,0.975; 2 -2.875,0.325; 3 -2.875,-0.325; 4 -2.875,-0.975; 5 2.875,-0.975; 6 2.875,-0.325; 7 2.875,0.325; 8 2.875,0.975
SOLARCOMPONENTS_SON40P300X300X80-15N = smd 0.75 x 0.2: 1 -1.5,1.2; 2 -1.5,0.8; 3 -1.5,0.4; 4 -1.5,0; 5 -1.5,-0.4; 6 -1.5,-0.8; 7 -1.5,-1.2; 8 1.5,-1.2; 9 1.5,-0.8; 10 1.5,-0.4; 11 1.5,0; 12 1.5,0.4; 13 1.5,0.8; 14 1.5,1.2 | smd 1.8 x 2.4: 15 0,0
FT230XQ_QFN16 = smd 0.8 x 0.35: 1 -2,0.975; 2 -2,0.325; 3 -2,-0.325; 4 -2,-0.975; 9 2,-0.975; 10 2,-0.325; 11 2,0.325; 12 2,0.975 | smd 0.35 x 0.8: 5 -0.975,-2; 6 -0.325,-2; 7 0.325,-2; 8 0.975,-2; 13 0.975,2; 14 0.325,2; 15 -0.325,2; 16 -0.975,2 | smd 2.032 x 2.032: 17 0,0
BQ29700DSET_SON50P150X150X80-6N = smd 0.95 x 0.3: 1 -0.65,0.5; 2 -0.65,0; 3 -0.65,-0.5; 4 0.65,-0.5; 5 0.65,0; 6 0.65,0.5
TPS63031DSKT_SON50P250X250X80-11N = smd 0.8 x 0.3: 1 -1.25,1; 2 -1.25,0.5; 3 -1.25,0; 4 -1.25,-0.5; 5 -1.25,-1; 6 1.25,-1; 7 1.25,-0.5; 8 1.25,0; 9 1.25,0.5; 10 1.25,1 | smd 1.3 x 2.1: 11 0,0
MCP73831T-2ACI_OT_SOT95P280X145-5N = smd 1.27 x 0.559: 1 -1.295,0.94; 2 -1.295,0; 3 -1.295,-0.94; 4 1.295,-0.94; 5 1.295,0.94
74XX-LITTLE-DE_SC70-5 = smd 0.4 x 0.7: 1 -0.65,-0.85; 2 0,-0.85; 3 0.65,-0.85; 4 0.65,0.85; 5 -0.65,0.85

### Placement (x,y rotation side)
B1  25.65,48.51 180 top
B2  63.75,2.79 0 top
C1  14.1,25.81 90 top
C2  30.12,34.44 0 top
C3  30.1,39.44 0 top
C4  30.1,41.16 0 top
C5  34.39,38.07 270 top
C6  21.72,14.55 90 top
C7  18.08,35.94 0 top
C8  46.74,38.72 90 top
C9  45.26,36.03 0 top
C10  9.5,40.01 0 top
C11  34.82,32.61 180 top
C12  42.74,34.62 270 top
C13  51.35,13.13 270 top
C14  60.45,34.66 270 top
C15  61.87,38.08 270 top
C16  61.87,41.14 90 top
C17  49.65,13.14 270 top
C24  52.4,47.32 90 top
C25  54.27,47.32 90 top
C26  53.33,44.14 0 top
CF  25.35,18.5 180 top
CMPP  26.67,12.67 0 top
COUT1  30.33,17.75 0 top
COUT2  29.44,23.11 90 top
J2  67.22,39.99 90 top
J3  3.65,37.79 0 top
J4  3.58,31.42 90 top
J5  55.55,16.44 270 top
J6  65.15,10.29 270 top
JP1  19.72,39.27 90 top
K1  42.06,26.95 90 top
L1  41.3,15.93 180 top
L2  26.51,36.96 270 top
L3  56.86,34.17 180 top
LED_CH  37.11,41.91 180 top
LED_RX  64.77,48.51 0 top
LED_TX  64.77,47.12 0 top
Q1  8.81,17.75 0 top
Q2  8.81,21.89 180 top
Q3  44.42,40.06 180 top
R1  21.92,18.92 270 top
R2  19.48,14.53 270 top
R3  32.08,12.8 0 top
R4  23.36,42.44 180 top
R5  21.78,29.82 180 top
R8  26.47,10.08 0 top
R9  18.74,24.1 0 top
R10  15.11,23.22 180 top
R14  66.35,45.32 0 top
R23  57.59,38.59 0 top
R24  42.09,39.92 90 top
R25  45.46,43.77 90 top
R26  48.06,43.69 180 top
R27  62,45.49 270 top
R28  60.02,45.49 270 top
R29  57.58,40.68 180 top
RES_SEL  6.86,41.87 270 top
RF1  26.26,21.49 270 top
RF2  24.49,21.51 270 top
RGPIO1  51.16,6.2 90 top
RGPIO2  53.62,6.17 90 top
RGPIO3  56.18,6.2 90 top
RGPIO4  58.72,6.15 90 top
RGS1  11.43,14.05 270 top
RGS2  6.07,24.38 270 top
RLED1  38.25,39.83 0 top
RPROG1  40.34,44.7 90 top
RRX  62.74,24.56 0 top
RS1  29.42,20 90 top
RTEMP  7.9,37.74 180 top
RX_TX  66.81,24.64 90 bottom
SCL  57.54,23.81 0 top
SCL_SDA  66.81,18.28 90 top
SDA  57.56,19.91 180 top
U1  26.54,15.36 180 top
U2  16.13,39.67 180 top
U3  50.85,39.77 90 top
U4  16.34,26.54 270 top
U5  30.47,36.91 0 top
U6  39.75,36.55 0 top
U7  61.18,27.31 270 top

### Tracks (layer width: path | path; a pad name or v marks a point on that pad's centre or on a via)
AAAA
  cutout Bottom: 61.72,32.31 65.18,32.31 65.18,24.1 59.66,24.1 59.66,32.31
ALRT
  Top 0.152: U2.12 13.22,39.27 7.86,33.91 5.33,33.91 4.5,33.07 4.5,25.78 3.73,25.02 3.73,15.55 4.06,15.21 4.06,4.06 B1.DIO15
BAAB
  cutout Top (isolate 0.025): 65.41,36.32 66.17,36.32 66.17,35.94 64.9,35.94 64.77,36.07 64.9,36.07 65.02,36.2 65.28,36.2
BAT_DETECTION  (1 unrouted)
  Top 0.152: 7.03,37.79 J3.1
BOH
  cutout Top (isolate 0.305): 60.71,27.69 61.72,27.69 61.72,26.16 60.71,26.16
DIO1_RESERVED
  Top 0.152: B1.DIO1-RESET 2.79,42.03 3.98,40.85 RES_SEL.3
DIO22
  Top 0.152: B1.DIO22 16.8,47.21 16.8,44.69 14.69,42.58 14.4,42.58 14.39,42.58 8,42.58 7.7,42.88 RES_SEL.1
DP5_UART_FTDI_RX
  Top 0.381: RRX.1 61.84,26.46 U7.4
FTDI_RX  (via drill 0.35)
  Top 0.152: RX_TX.2 62.83,27.18
  Top 0.381: v62.23,32.77 62.23,28.92 62.83,28.32 62.83,27.18 62.83,26.58 63.71,25.7 63.71,24.64 RRX.2 | U3.2 50.58,37.72 50.58,37.45 50.55,37.41 50.55,35.43 52.12,33.86 v52.12,33.58
  Bottom 0.381: v62.23,32.77 62.27,32.8 62.34,32.8 62.34,32.91 61.98,33.27 52.42,33.27 v52.12,33.58
FTDI_TX  (via drill 0.35)
  Top 0.152: U3.15 48.86,39.45 49.2,39.45 49.53,39.12 49.53,38.46 48.05,36.97 48.05,34.86 48.08,34.82 48.05,34.82 v48.04,34.84 | RX_TX.1 65.64,23.47 59.72,23.47 v59.71,23.49
  Bottom 0.152: v48.04,34.84 48.36,34.84 54.87,28.32 54.87,28.08 55.94,27.02 56.56,27.02 59.71,23.87 v59.71,23.49
GND  (via drill 0.35)
  Top 0.203: 14.76,41 U2.8 U2.9
  Top 0.254: v16.13,41 14.76,41
  Top 0.381: 31.06,37.41 30.99,37.34 30.73,37.34 30.47,37.08 U5.11
  Top 1.016: U5.11 30.47,38.17 31.04,38.74 31.07,38.74 31.34,39.01 31.34,40.82
  Bottom 0.152: 9.91,43.18 9.92,43.18
  other vias: 55.5,44.16 7.32,35.46 62.99,35.79 51.31,35.81 10.43,43.94 17.91,25.27 21.46,25.91 62.51,15.72 58.95,32.23 3.25,52.27 7.06,52.27 10.87,52.27 14.68,52.27 63.63,45.09 12.83,24 7.17,44.08 2.84,32.89 2.84,30.35 7.11,39.88 4.57,39.88 15.76,40.39 15.76,39.12 16.52,39.12 16.52,40.39 30.48,37.59 30.48,36.32 4.57,43.69 16.76,43.69 12.96,43.29 24.64,44.07 25.78,14.35 27.81,14.35 27.81,16.13 3.94,1.14 14.35,1.14 24.26,1.14 27.05,1.14 31.88,1.14 66.93,1.4 49.56,10.57 55.7,9.27 50.29,40.39 50.29,39.24 51.44,39.24 51.44,40.39 6.48,16.38 6.48,15.11 7.75,15.11 9.02,15.11 9.02,13.84 7.75,13.84 6.48,13.84 12.7,36.32 23.24,44.07 21.84,44.07 31.12,14.35 33.12,14.35 47.12,29.06 46.48,48.13 49.02,48.13 21.46,28.42 12.8,40.51 54.2,36.78 12.65,30.76 15.24,35.05 39.37,20.57 44.45,20.57 46.99,18.03 41.91,18.03 39.37,15.49 44.45,15.49 41.91,12.95 5.51,9.12 32.51,29.72 29.97,29.72 31.24,27.18 51.56,28.45 62.99,5.59 67.44,46.89 67.44,49.43 67.44,51.97 62.89,43.31 60.17,40.94 57.68,30.96 56.41,32.23 32.11,4.22 39.7,1.17 42.24,1.17 44.78,1.17 44.75,4.24 42.21,4.24 39.67,4.24 28.07,48.49 20.93,32.89 18.39,32.89 2.77,9.12 10.19,34.67 34.34,34.67 35.74,37.34 30.76,44.25 30.61,48.49 27.18,44.07 62.51,13.18 59.97,15.72 41.91,9.14 46.99,9.14 44.45,24.38 35.69,45.57 37.92,44.32 32.03,45.52 33.02,18.03 54.1,18.29 52.83,20.83 56.64,22.1 64.52,20.19 56.01,48.13 43.94,48.13 41.4,48.13 38.86,48.13 43.94,51.31 38.23,52.58 49.66,52.58 62.36,52.58 48.01,44.96 41.91,23.11 33.17,23.78 46.15,34.65 8.05,11.66 10.59,9.12 13.13,11.66 15.67,9.12 18.21,11.66 20.75,9.12 15.67,14.2 13.13,16.74 18.21,16.74 15.67,19.28 13.13,21.82 2.77,14.2 2.77,19.28 2.77,24.36 0.84,6.6 0.84,14.22 0.84,19.3 0.84,24.38 0.84,31.6 0.84,37.08 0.84,42.16 59.97,13.18 65.05,15.72 65.05,10.64 6.25,27.57 51.34,10.61 55.36,39.57 24.99,24.22 38.09,9.92 38.09,7.38 33.01,7.38 33.01,9.92 30.47,9.92 30.47,7.38 43.85,30.71 18.21,21.82
  pour Bottom (isolate 0.305, rank 6): 0,53.59 68.33,53.59 68.33,53.09 68.83,52.58 68.83,0 0,0
  pour Top (isolate 0.305, rank 6): -0.25,53.85 69.6,53.85 69.6,53.59 69.6,-1.02 -0.76,-1.02 -0.76,0.51 -0.76,53.85
  pour Top (rank 6, no thermals): 5.84,16.69 9.42,16.69 9.42,15.88 9.65,15.65 9.65,13.21 5.87,13.21 5.84,13.18
  pour Top (rank 6, no thermals): 5.84,16.69 9.42,16.69 9.42,15.88 9.65,15.65 9.65,13.21 5.87,13.21 5.84,13.18
  pour Bottom (no thermals): 5.84,16.69 7.11,16.69 7.92,15.88 9.02,15.88 9.6,15.29 9.6,13.54 9.32,13.26 6.22,13.26 5.84,13.64
  pour Top (no thermals): 29.78,14.88 30.94,13.72 33.71,13.72 33.78,13.79 33.78,14.71 33.63,14.86 30.63,14.86 30.28,15.21 28.24,15.21 28.58,14.88
  pour Top (no thermals): 64.54,41.1 63.5,41.1 63.5,41.5 64.52,41.5
  pour Bottom (no thermals): 15.65,41.73 17.25,40.13 17.25,39.42 17.25,38.58 16.89,38.23 15.29,38.23 15.04,38.48 15.04,41.25 15.32,41.53
  pour Bottom (no thermals): 29.84,37.9 29.84,35.86 29.82,35.84 31.14,35.84 31.14,37.87 31.17,37.9 30.12,37.9 30.1,37.87
  pour Bottom (no thermals): 49.53,41.1 49.53,39.04 49.56,39.01 51.51,39.01 51.74,39.24 51.74,41.1
  pour Top (no thermals): 48.64,40.51 49.28,40.51 49.78,40.01 49.78,38.61 50.67,38.61 50.93,38.35 50.93,36.32 50.93,35.56 52.45,34.04 53.72,34.04 53.85,34.04 54.36,34.54 54.36,35.81 54.86,36.32 54.86,37.21 54.48,37.59 54.1,37.59 52.7,37.59 52.7,35.94 52.58,35.81 51.82,35.81 51.44,36.2 51.44,38.23 51.94,38.73 51.94,40.89 50.04,40.89 49.66,41.28 48.77,41.28 48.51,41.02 48.39,40.89 48.39,40.64 48.51,40.51
  pour Top (no thermals): 29.84,34.04 30.1,33.78 31.5,33.78 31.88,34.16 35.18,34.16 35.18,35.18 32.51,35.18 32.26,35.43 31.24,35.43 31.12,35.56 31.12,37.21 32.26,37.21 32.26,37.59 31.24,37.59 31.24,38.35 31.62,38.35 32.26,38.99 32.26,42.16 30.73,42.16 30.61,42.29 30.35,42.04 30.35,38.99 29.84,38.48 29.84,37.08 28.83,37.08 28.83,36.7 29.84,36.7
GPIO1
  Top 0.152: 51.12,5.26 RGPIO1.1 51.16,2.9 B2.PO.03
GPIO2
  Top 0.152: RGPIO2.1 53.62,2.82 B2.PO.04
GPIO3
  Top 0.152: RGPIO3.1 56.19,2.85 B2.PO.28
GPIO4
  Top 0.152: 58.74,5.23 RGPIO4.1 58.73,2.85 B2.PO.29
GROUND_CUT
  cutout Bottom: 19.05,38.48 40.39,38.48 40.39,42.29 19.05,42.29
N$1  (1 unrouted)
  Top 0.152: C13.1 51.06,14.33 49.9,14.33
  Top 0.381: R3.2 34.23,11.56 45.85,11.56 49.26,14.97
  Top 1.778: J5.3 55.11,11.36 52.15,14.33 49.9,14.33 49.26,14.97 L1.P$1
N$2  (via drill 0.35)
  Top 0.152: U6.5 40.82,37.71 v40.82,38.54 | RPROG1.1 40.88,43.26 v40.88,41.76
  Bottom 0.152: v40.82,38.54 40.82,41.59 40.89,41.66 40.88,41.67 v40.88,41.76
N$3
  Top 0.15: U1.1 29.41,14.35
  Top 0.381: R8.2 29.39,12.11 29.39,12.68 | R3.1 30.46,13.52 30.23,13.52
  Top 0.635: 29.41,14.35 30.23,13.52 29.39,12.68 CMPP.2
N$4
  Top 0.381: R8.1 23.66,11.99 U1.8
N$5
  Top 0.15: RS1.1 29.42,19.71 29.31,19.81 27.89,19.81 27.23,20.47 27.23,21.42 RF1.1
  Top 0.178: RS1.1
  pour Top (no thermals): 28.85,16.13 29.9,16.13 29.95,16.18 29.95,16.79 30.53,17.37 30.53,19.13 30.15,19.51 28.73,19.51 28.7,19.48 28.65,19.48 27.84,18.67 27.84,17.14
N$6
  Top 0.152: 26.21,20.8 26.26,20.74 26.26,20.63 RF1.2 26.02,20.59 25.48,20.04 25.48,19.19 26.17,18.5 CF.1 25.48,17.73 25.48,16.34 24.47,15.34 24.47,15.33 24.18,15.04 U1.7
  Top 0.381: 26.25,20.61 26.26,20.63
N$7  (1 unrouted)
  Top 0.152: 24.41,20.55 24.43,20.55 RF2.2 24.54,20.61 25.15,20 25.15,19.2 CF.2 25.15,17.8 25.15,16.48 24.36,15.69 U1.6 23.66,15.67
  Top 0.381: 24.43,18.3 24.55,18.18 | 24.45,20.58 RF2.2
N$8
  Top 0.305: U5.4 28.2,36.41 27.9,36.11 L2.2
N$9
  Top 0.381: RLED1.1 37.35,40.79 LED_CH.C
N$10
  Top 0.152: 21.9,15.45 21.95,15.4 | R2.1 19.49,15.45
  Top 0.381: U1.5 23.64,16.36 22.91,16.36 | 21.95,15.4 22.91,16.36 | 19.49,15.45 C6.2 21.9,15.45 | R1.2 21.92,17.34 22.91,16.36
N$11
  Top 0.152: U5.7 32.22,36.41 32.64,35.99 33.86,35.99 | U5.6 32.29,35.91 32.71,35.48 33.86,35.48 33.86,35.99 | 33.86,35.99 33.86,36.3 33.25,36.91
  Top 0.305: U5.8 32.54,36.91 33.25,36.91
  Top 0.381: C5.2 32.8,37.18 32.54,36.91
N$12
  Top 0.305: U5.2 28.38,37.41
  Top 0.635: 28.38,37.41 28,37.79 27.71,37.79 27.7,37.81 L2.1
N$13
  Top 0.381: U6.1 38.46,39.13 RLED1.2
N$14  (via drill 0.35)
  other vias: 8.38,18.29 9.65,18.29 9.65,21.44 8.38,21.44 8.31,19.84 9.58,19.84
  pour Top (no thermals): 4.14,22.45 10.44,22.45 10.46,22.43 10.46,16.99 4.14,16.99
  pour Bottom (no thermals): 4.57,23.37 4.57,17.02 10.92,17.02 10.92,23.37 5.84,23.37
N$15
  Top 0.254: U4.2 16.34,27.99 | 11.43,15.24 RGS1.1 10.92,15.45 10.92,16.31
  Top 0.381: 16.34,27.99 16.08,28.24 15.57,28.24 14.38,29.44 12.85,29.44 10.92,27.51 10.92,16.31 Q1.4
N$16
  Top 0.152: J6.2 J6.P$2
  Top 1.778: J5.2 56.41,13.9 57.51,12.8 57.51,9.8 58.29,9.02 J6.P$2
N$17
  Top 0.152: JP1.2 19.21,39.27 18.41,38.47 U2.1
N$18
  Top 0.152: 31.04,15.95 30.79,15.7 30.44,15.7
  Top 0.508: 30.44,15.7 U1.3
  Top 1.778: L1.P$2 34.13,15.93 34.1,15.95 31.04,15.95
N$19  (via drill 0.35)  (1 unrouted)
  Top 0.152: J4.1 7.55,30.15 J4.P$1
  Top 0.254: 6.22,25.3 7.59,26.67 9.37,26.67
  Top 0.305: 15.02,26.71 U4.4
  Top 0.381: 15.02,26.71 C1.2 14.07,26.73 14.07,27.18 13.72,27.53 v13.72,28.19
  Top 1.778: J4.1 8.68,30.42
  Top 2.032: 9.27,24.26 9.27,25.2 9.37,25.29 9.37,26.67 9.37,29.44 J4.P$1
  Bottom 0.152: v13.72,28.19 12.19,28.19 10.24,30.15 J4.P$1
  pour Top (no thermals): 8.26,23.88 8.26,22.86 10.03,22.86 10.29,23.11 10.29,24.51 8.64,24.51 8.26,24.13
N$20
  Top 0.152: 35.75,32.91 35.72,32.89 C11.1 35.72,32.88 35.87,33.02
  Top 0.762: 35.87,33.02 U6.3
  Top 1.27: 35.75,32.91 35.75,30.79 K1.12
N$21  (via drill 0.35)  (1 unrouted)
  Top 0.152: v10.16,37.92 9.09,37.92 9.09,37.9 | v19.05,37.36 19.72,38.03 JP1.1 | v18.8,42.11 18.8,42.09 18.6,41.89 12.21,41.89 11.72,41.4 v10.16,41.4
  Bottom 0.152: v10.16,41.4 v10.16,37.92 | v18.8,42.11 18.29,41.61 18.29,38.1 19.05,37.34 v19.05,37.36
N$22  (via drill 0.35)  (1 unrouted)
  Top 0.152: 6.18,23.36 6.14,23.32
  Top 0.254: 6.14,23.32 Q2.4 | 15.69,27.19 U4.3
  Top 0.381: v7.87,25.91 7.84,25.87 Q2.4 | v12.7,25.91 12.7,28.45 13.13,28.88 14,28.88 15.69,27.19
  Bottom 0.381: v12.7,25.91 v7.87,25.91
N$23
  Top 0.152: 63.63,26.42 63.75,26.42
N$24  (1 unrouted)
  Top 0.254: 16.34,25.05 U4.5
  Top 0.381: 16.34,25.05 16.19,24.91 C1.1 14.1,23.27 14.09,23.27
N$25  (2 unrouted)
  Top 0.508: J2.1 63.59,38.69 62.99,38.1 60.64,38.1 60.39,37.85
  Top 1.016: 58.55,34.17 L3.1
  Top 1.27: 60.39,37.85 60.39,35.65 | 59.95,35.57 59.01,34.62 58.55,34.17
N$26
  Top 0.381: C8.2 46.74,40.89 46.56,41.06
  Top 0.635: R26.2 47.16,41.66 46.56,41.06 Q3.1 45.37,42.78 R25.1
N$27
  Top 0.152: J2.4 65.86,40.64 65.86,44.13 66.08,44.35 67,44.35 67.25,44.59 R14.2
N$28
  Top 0.152: RGPIO1.2 50.72,7.1 48.61,4.99 27.83,4.99 26.04,6.78 17.55,6.78 17.5,6.78 15.21,6.78 14.25,5.82 14.25,4.09 B1.MOSI
N$29
  Top 0.254: U4.6 16.84,24.26 17.01,24.09 R9.1
N$30
  Top 0.152: RGPIO2.2 52.82,7.87 50.58,7.87 50.3,7.6 50.3,7.15 48.47,5.32 28.02,5.32 26.15,7.18 13.08,7.18 11.68,5.79 11.68,4.06 B1.MISO
N$31  (via drill 0.35)
  Top 0.381: v49.87,42.54 49.88,42.53 U3.12 | R28.2 57.85,42.42 v54.1,42.42
  Bottom 0.381: v54.1,42.42 53.98,42.55 v49.86,42.55 v49.87,42.54
N$32  (via drill 0.35)
  Top 0.381: LED_RX.C 64.63,49.53 v63.25,49.53 | v60.45,47.5 60.02,47.07 R28.1
  Bottom 0.381: v63.25,49.53 60.71,49.53 60.45,49.28 v60.45,47.5
N$33
  Top 0.152: RGPIO3.2 54.95,7.1 53.84,8.2 50.44,8.2 49.98,7.74 49.98,7.3 48.32,5.65 28.2,5.65 26.28,7.57 13.06,7.57 12.82,7.57 10.54,7.57 9.12,6.15 9.12,4.04 B1.BTN1
N$34  (via drill 0.35)
  Top 0.152: v48.26,38.21 v48.27,38.21 U3.16
  Bottom 0.152: v48.26,38.21 48.26,37.85 48.77,37.33 52.02,37.33 54.71,34.65 64.62,34.65 65.61,33.66 65.61,30.92 RX_TX.3
N$35  (via drill 0.35)
  Top 0.381: v62.99,34.04 64.52,34.04 66.29,32.26 RX_TX.4
  Top 0.508: v52.07,36.4 52.07,37.53 U3.4
  Bottom 0.381: v52.07,36.4 54.43,34.04 v62.99,34.04
N$36  (via drill 0.35)
  Top 0.152: SDA.3 54.3,22.15 54.3,25.03 53.86,25.47 53.14,25.47 v52.07,26.54
  Bottom 0.152: v52.07,26.54 51.56,26.03 30.35,26.03 28.98,27.41 28.98,34.76 25.09,38.65 21.63,38.65 19.79,36.8 18.72,36.8 17.95,37.57 17.95,40.45 14.18,44.23 14.18,46.48 13.46,47.19 12.48,47.19 11.75,47.93 11.75,48.89 10.58,50.06 4.34,50.06 B1.SDA_FG
N$37  (via drill 0.35)
  Top 0.152: SCL.1 56.53,24.44 55.52,25.44 54.35,25.44 53.99,25.8 53.7,25.8 v53.09,26.42
  Bottom 0.152: B1.SCL_FG 5.4,48.46 6.67,49.73 8.37,49.73 9.21,48.89 9.21,47.87 9.87,47.22 10.91,47.22 11.75,46.38 11.75,45.45 12.55,44.65 13.27,44.65 17.62,40.29 17.62,37.42 18.59,36.45 19.9,36.45 21.77,38.32 24.93,38.32 28.65,34.6 28.65,27.23 30.18,25.7 52.38,25.7 v53.09,26.42
N$38  (via drill 0.35)
  Top 0.152: v61.21,22.35 61.21,20.83 60.29,19.91 SDA.1
  Bottom 0.152: B2.SDA_FG 23.12,49.78 30.57,49.78 33.51,46.84 36.81,46.84 55.2,28.45 55.2,28.22 56.08,27.35 56.69,27.35 61.21,22.82 v61.21,22.35
N$39  (via drill 0.35)
  Top 0.152: SCL.3 58.55,23.82 58.55,24.41 58.01,24.94 57.56,24.94 v57.43,25.07 | v36.58,42.93 38.61,42.93 40.83,40.71 41.5,40.03 44.7,40.03 45.96,38.77 47.43,38.77 47.66,38.53 47.66,36.07 47.49,35.9 v47.49,35.38
  Bottom 0.152: v36.58,42.93 36.47,42.93 32.21,47.19 22.75,47.19 21.77,48.18 21.77,49.01 21.07,49.71 20.65,49.71 B2.SCL_FG | v47.49,35.38 47.49,35.07 47.49,34.61 47.81,34.29 48.45,34.29 54.55,28.18 54.55,27.95 55.8,26.69 56.42,26.69 57.4,25.71 57.4,25.09 v57.43,25.07
N$41
  Top 0.152: RGPIO4.2 58,7.77 54.74,7.77 53.98,8.53 50.31,8.53 49.65,7.87 49.65,7.49 48.16,5.99 28.36,5.99 26.36,8 10.92,8 10.71,8 8.51,8 6.58,6.07 6.58,4.04 B1.BTN2
N$42
  Top 0.381: LED_TX.C 64.75,46.23 63.3,46.23 63.13,46.39 R27.1
N$43  (via drill 0.35)
  Top 0.381: v54.1,41.15 54.23,41.28 55.65,41.28 56.15,41.77 58.84,41.77 61.66,44.59 R27.2 | v54.1,38.61 53.92,38.79 U3.5
  Bottom 0.381: v54.1,41.15 v54.1,38.61
N$45
  Top 0.152: U2.11 10.9,39.67 10.57,40.01 C10.2
NRF_RESET  (via drill 0.35)
  Top 0.152: v22.3,36.51 22.23,36.59 22.23,40.18 19.71,42.7 18.49,42.7 18.05,42.25 7.99,42.25 7.61,41.87 RES_SEL.2
  Bottom 0.152: B2.DIO1-RESET 33.23,2.79 34.42,3.98 34.42,14.25 35.49,15.32 35.49,16.46 31.34,20.61 30.34,20.61 25.2,25.74 25.2,32.16 22.53,34.84 22.53,36.29 v22.3,36.51
PACK+  (1 unrouted)
  Top 0.152: 17.43,40.87 U2.7 17.98,41.21 20.21,41.21 21.54,39.88 21.54,37 21.39,36.86 21.39,36.12 21.54,35.98 21.54,30.99 20.37,29.81 R5.2 | JP1.3 20.23,40.29 | 15.94,32.02 16.2,32.27 | J4.2 8.39,32.42 J4.P$2
  Top 0.203: U2.6 19.32,40.47
  Top 0.381: JP1.3 20.37,40.29 20.88,39.78 20.88,37.84 | 20.88,37.77 20.88,37.84 | 18.65,29.81 18.69,29.77 18.69,23.29 18.46,23.05 16.18,23.05 R10.1 | 20.88,37.84 C7.2 16.2,33.15 16.2,32.27
  Top 0.889: 10.82,32.27 10.67,32.42
  Top 1.27: J4.2 10.67,32.42 11.34,32.42
  Top 1.778: 10.82,32.27 16.2,32.27 18.65,29.81 R5.2
PO.22(CTS)-DIO18(RTS)
  Bottom 0.152: B2.PO.22(CTS)-DIO18(RTS) 34.9,53.24 18.31,53.24 16.87,51.79 16.87,50.89 16.7,50.72 2.02,50.72 1.2,49.89 1.2,45.1 1.73,44.57 1.73,7.89 2.12,7.5 13.33,7.5 B1.PO.22(CTS)-DIO18(RTS)
PO.23(RTS)-DIO19(CTS)
  Bottom 0.152: B2.PO.23(RTS)-DIO19(CTS) 32.69,52.91 18.46,52.91 17.2,51.64 17.2,50.75 16.84,50.39 2.16,50.39 1.52,49.76 1.52,45.24 2.06,44.7 2.06,8.03 2.26,7.82 15.54,7.82 B1.PO.23(RTS)-DIO19(CTS)
PO.24(TX)-DIO2(RX)  (via drill 0.35)
  Top 0.152: v56.39,27.9 58.97,27.9 59.56,27.31 U7.2
  Bottom 0.152: v56.39,27.9 56.39,28.59 55.98,29 55.58,29 37.08,47.5 33.78,47.5 32,49.28 B2.PO.24(TX)-DIO2(RX) 30.48,52.58 18.64,52.58 17.53,51.46 17.53,49.86 18.03,49.35 B1.PO.24(TX)-DIO2(RX)
PO.25(RX)-DIO3(TX)  (via drill 0.35)
  Top 0.152: R4.2 22.31,42.44 19.36,45.39 19.36,47.3 B1.PO.25(RX)-DIO3(TX) | v55.75,28.45 59.84,28.45 U7.1
  Bottom 0.152: B2.PO.25(RX)-DIO3(TX) 30.4,50.11 30.7,50.11 33.65,47.17 36.95,47.17 55.67,28.45 v55.75,28.45 | 28.96,51.56 B2.PO.25(RX)-DIO3(TX) | B2.PO.25(RX)-DIO3(TX) 28.27,52.25 18.8,52.25 18.09,51.54 18.09,50.55 20.12,48.51 B1.PO.25(RX)-DIO3(TX)
POWER_INPUT  (via drill 0.65)
  Top 0.152: R5.1 23.02,29.81 21.87,30.96 21.87,36.14 21.72,36.29 21.72,36.71 21.87,36.86 21.87,40.06 20.37,41.55 14.45,41.55 13.91,41.02 13.91,40.34 14.18,40.07
  Top 0.203: 14.18,40.07 U2.10
  Top 0.305: U5.5 C2.1
  Top 0.508: 29.77,32.77 29.53,33.01 29.22,33.01
  Top 0.889: 29.22,33.01 C2.1
  Top 1.778: v32.23,32.84 32.11,32.84 32.03,32.77 29.77,32.77 26.82,29.81 R5.1
  Bottom 1.778: v30.58,32.84 v32.23,32.84 46.33,32.84 K1.7
PWR_EN#
  Top 0.381: R26.1 48.96,41.94 48.03,41.01 48.03,40.48 48.41,40.1 U3.14
SCL_FG  (via drill 0.35)
  Top 0.152: v54.61,26.04 55.63,26.04 57.54,24.12 SCL.2 57.66,23.69 57.66,22.86 v58.42,22.1 | v63.25,21.59 66.04,21.59 SCL_SDA.2 | U2.14 13.77,38.47 13.77,37.23 v13.78,37.22
  Bottom 0.152: v58.42,22.1 58.93,21.59 v63.25,21.59 | v54.61,26.04 54.56,26.09 54.3,26.09 52.74,24.52 52.37,24.52 51.87,25.02 29.87,25.02 27.99,26.9 27.99,34.29 24.64,37.64 22.07,37.64 20.22,35.79 18.27,35.79 16.84,37.21 v13.79,37.21 v13.78,37.22
SDA_FG  (via drill 0.35)
  Top 0.152: 57.56,19.59 57.56,19.19 57.74,19.02 66.07,19.02 SCL_SDA.1 | U2.13 13.46,38.87 12.97,38.38 v12.97,38.14 | 57.56,19.59 56.99,19.02 56.12,19.02 55.98,19.17 55.98,19.84 53.98,21.84 53.98,24.89 53.72,25.15 v52.58,25.15 | 57.56,19.59 SDA.2
  Bottom 0.152: v52.58,25.15 52.38,25.35 30.02,25.35 28.32,27.05 28.32,34.43 24.77,37.98 21.91,37.98 20.05,36.12 18.44,36.12 16.76,37.8 13.31,37.8 v12.97,38.14
SOLAR_OUTPUT  (1 unrouted)
  Top 0.15: RS1.2 29.42,20.27 29.34,20.19 27.97,20.19 27.55,20.61 27.55,21.56 27.12,22 27.12,22.24
  Top 0.152: RS1.2 | 27.12,22.24 27.12,22.89 26.92,23.09 25.16,23.09 RF2.1 | 29.42,21.1 29.42,22.19 | 29.42,22.19 29.42,22.61 | 29.42,22.19 COUT2.1
  Top 0.381: 29.42,21.1 RS1.2 | R1.1 21.92,20.81 23.53,22.41 RF2.1
  Top 0.762: 30.94,21.08 29.44,21.08 29.42,21.1
  Top 1.778: J5.1 51.83,16.44 50.29,17.98 50.29,25.91 49.02,27.18 43.94,27.18 40.83,30.29 38.61,28.06 38.61,23.24 36.45,21.08 30.94,21.08
  pour Top (no thermals): 28.7,20.47 31.42,20.47 31.98,21.03 31.98,22.33 31.67,22.63 28.7,22.63 28.27,22.2 28.27,20.9
USBD_N  (1 unrouted)
  Top 0.15: 61.87,39.42 59.32,39.42 R23.2 | 61.87,38.9 61.87,39.42 | 61.87,39.42 64.47,39.42 J2.2
USBD_P  (1 unrouted)
  Top 0.15: 61.85,39.8 59.35,39.8 R29.1 | 61.85,40.36 61.85,39.8 | J2.3 64.07,39.99 63.88,39.8 61.85,39.8
USBDR_N
  Top 0.152: R23.1 55,38.59 54.36,37.95 52.83,37.95 52.2,38.58 52.2,39.75 52.54,40.09 U3.7
USBDR_P
  Top 0.152: R29.2 55.03,40.68 53.79,39.44 U3.6
VCC_FTDI  (via drill 0.35, 0.5)  (3 unrouted)
  Top 0.254: U3.10
  Top 0.381: U3.10 51.18,42.81
  Top 0.635: Q3.2 43.24,40.82 R24.2
  Top 1.27: 51.18,46.37 45.72,46.37 | 45.72,46.37 44.69,46.37 43.47,45.15 Q3.2 | 45.72,46.37 45.72,44.93 R25.2 | 51.18,42.81 51.18,46.37 | L3.2 55.96,34.71 v57.7,36.44 | 51.18,46.37 51.22,46.33 v57.65,46.33 v57.65,45.15 57.66,45.14
  Bottom 1.27: v57.65,46.33 57.65,36.5 v57.7,36.44
VCCIO_FTDI  (via drill 0.35)
  Top 0.152: 49.8,37.7 U3.1 49.88,37.72 49.8,37.64 | LED_TX.A 63.37,47.12
  Top 0.381: 54.88,33.76 54.63,34.01 | U7.5 61.49,27.96 60.31,29.14 57.16,29.14 54.88,31.43 54.88,33.76 | 54.88,33.76 54.88,35.58 v55.37,36.07 | v59.18,48.77 61.72,48.77 63.37,47.12 | v53.34,41.53 53.34,41.23 U3.8 U3.9 52.36,42.3 52.36,44.07 C26.1 | 49.8,37.7 v49.8,36.32 | LED_RX.A LED_TX.A
  Top 0.635: 49.8,37.64 48.64,36.48 48.64,35.7 52.33,32.01 52.63,32.01 54.63,34.01
  Bottom 0.381: v55.37,36.07 56.13,36.83 56.52,36.83 56.62,36.93 56.62,46.81 58.57,48.77 v59.18,48.77 | v53.34,41.53 52.18,40.37 52.18,39.01 51.69,38.53 48.93,38.53 48.54,38.91 47.9,38.91 47.59,38.6 47.59,37.89 48.66,36.81 49.31,36.81 v49.8,36.32
VDD  (via drill 0.35, 0.5)  (1 unrouted)
  Top 0.152: U5.10 32.09,38.28 v32.74,38.28 | R4.1 24.97,41.73 24.97,39.83 24.97,39.78
  Top 0.254: U5.1 29.27,37.91 | v28.04,38.58 28.04,40.87 28.45,41.28
  Top 1.524: B1.VDD 26.09,48.51 28.6,46 29.21,45.39
  Top 2.286: 23.98,35.84 23.98,38.84 24.97,39.83 27.43,42.29 28.83,42.29 28.83,45.77 28.6,46
  Bottom 0.152: v32.74,38.28 28.3,38.28 27.99,38.58 v28.04,38.58
  Bottom 2.286: B2.VDD@2 35.81,13.66 36.92,14.77 36.92,17.03 31.95,22 30.91,22 26.6,26.32 26.6,32.74 v23.98,35.36 v23.97,35.36 v23.97,36.24
  pour Top (no thermals): 29.62,37.74 29.62,38.58 30.02,38.99 30.02,44.78 27.69,44.78 27.69,42.29 28.32,41.66 28.32,38.99 28.47,38.84 28.78,38.56 28.8,37.74
VDD_CHARGER  (4 unrouted)
  Top 0.152: 43.61,35.52 C12.1
  Top 0.381: LED_CH.A 39,41.91 41.32,39.59 41.52,39.59 R24.1
  Top 0.635: R24.1 43.52,37.59 44.42,37.59 46.29,37.59
  Top 1.27: Q3.3 44.42,37.59 44.42,36.13
  Top 1.778: 44.26,35.94 41.38,35.94 U6.4 38.35,32.91 38.35,30.99 36.58,29.21 36.58,24 K1.1
  Bottom 1.016: K1.1 35.56,23.29
(copper drawn outside any net)
  shapes: Top area x3

### Text on the board
tDocu: SCL | SDA | GND | RX | TX | RTS | CTS | DIO22 | RX | TX | SDA | SCL | VDD | RX | TX | DIO1 | GND | USB_CHARGING | DIO22 | nRF_RST | DIO1 | BAT_ID_CFG | CTS | RTS | FTDI | RX | BATT | TX | CC | FG | nRF | SCL | FG_I2C | CC | FG | SDA | nRF | BYPASS | MPPT_BYPASS | EN | RTS | CTS | nRF_RST | PANEL | ALRT | IO4 | IO3 | IO2 | IO1 | GND | VDD | GND | GND | IO1 | IO2 | IO3 | IO4